# EAGLE design singleBandRepeater (EAGLE 9.6.1)

## Sheet 1 of 6: MCU
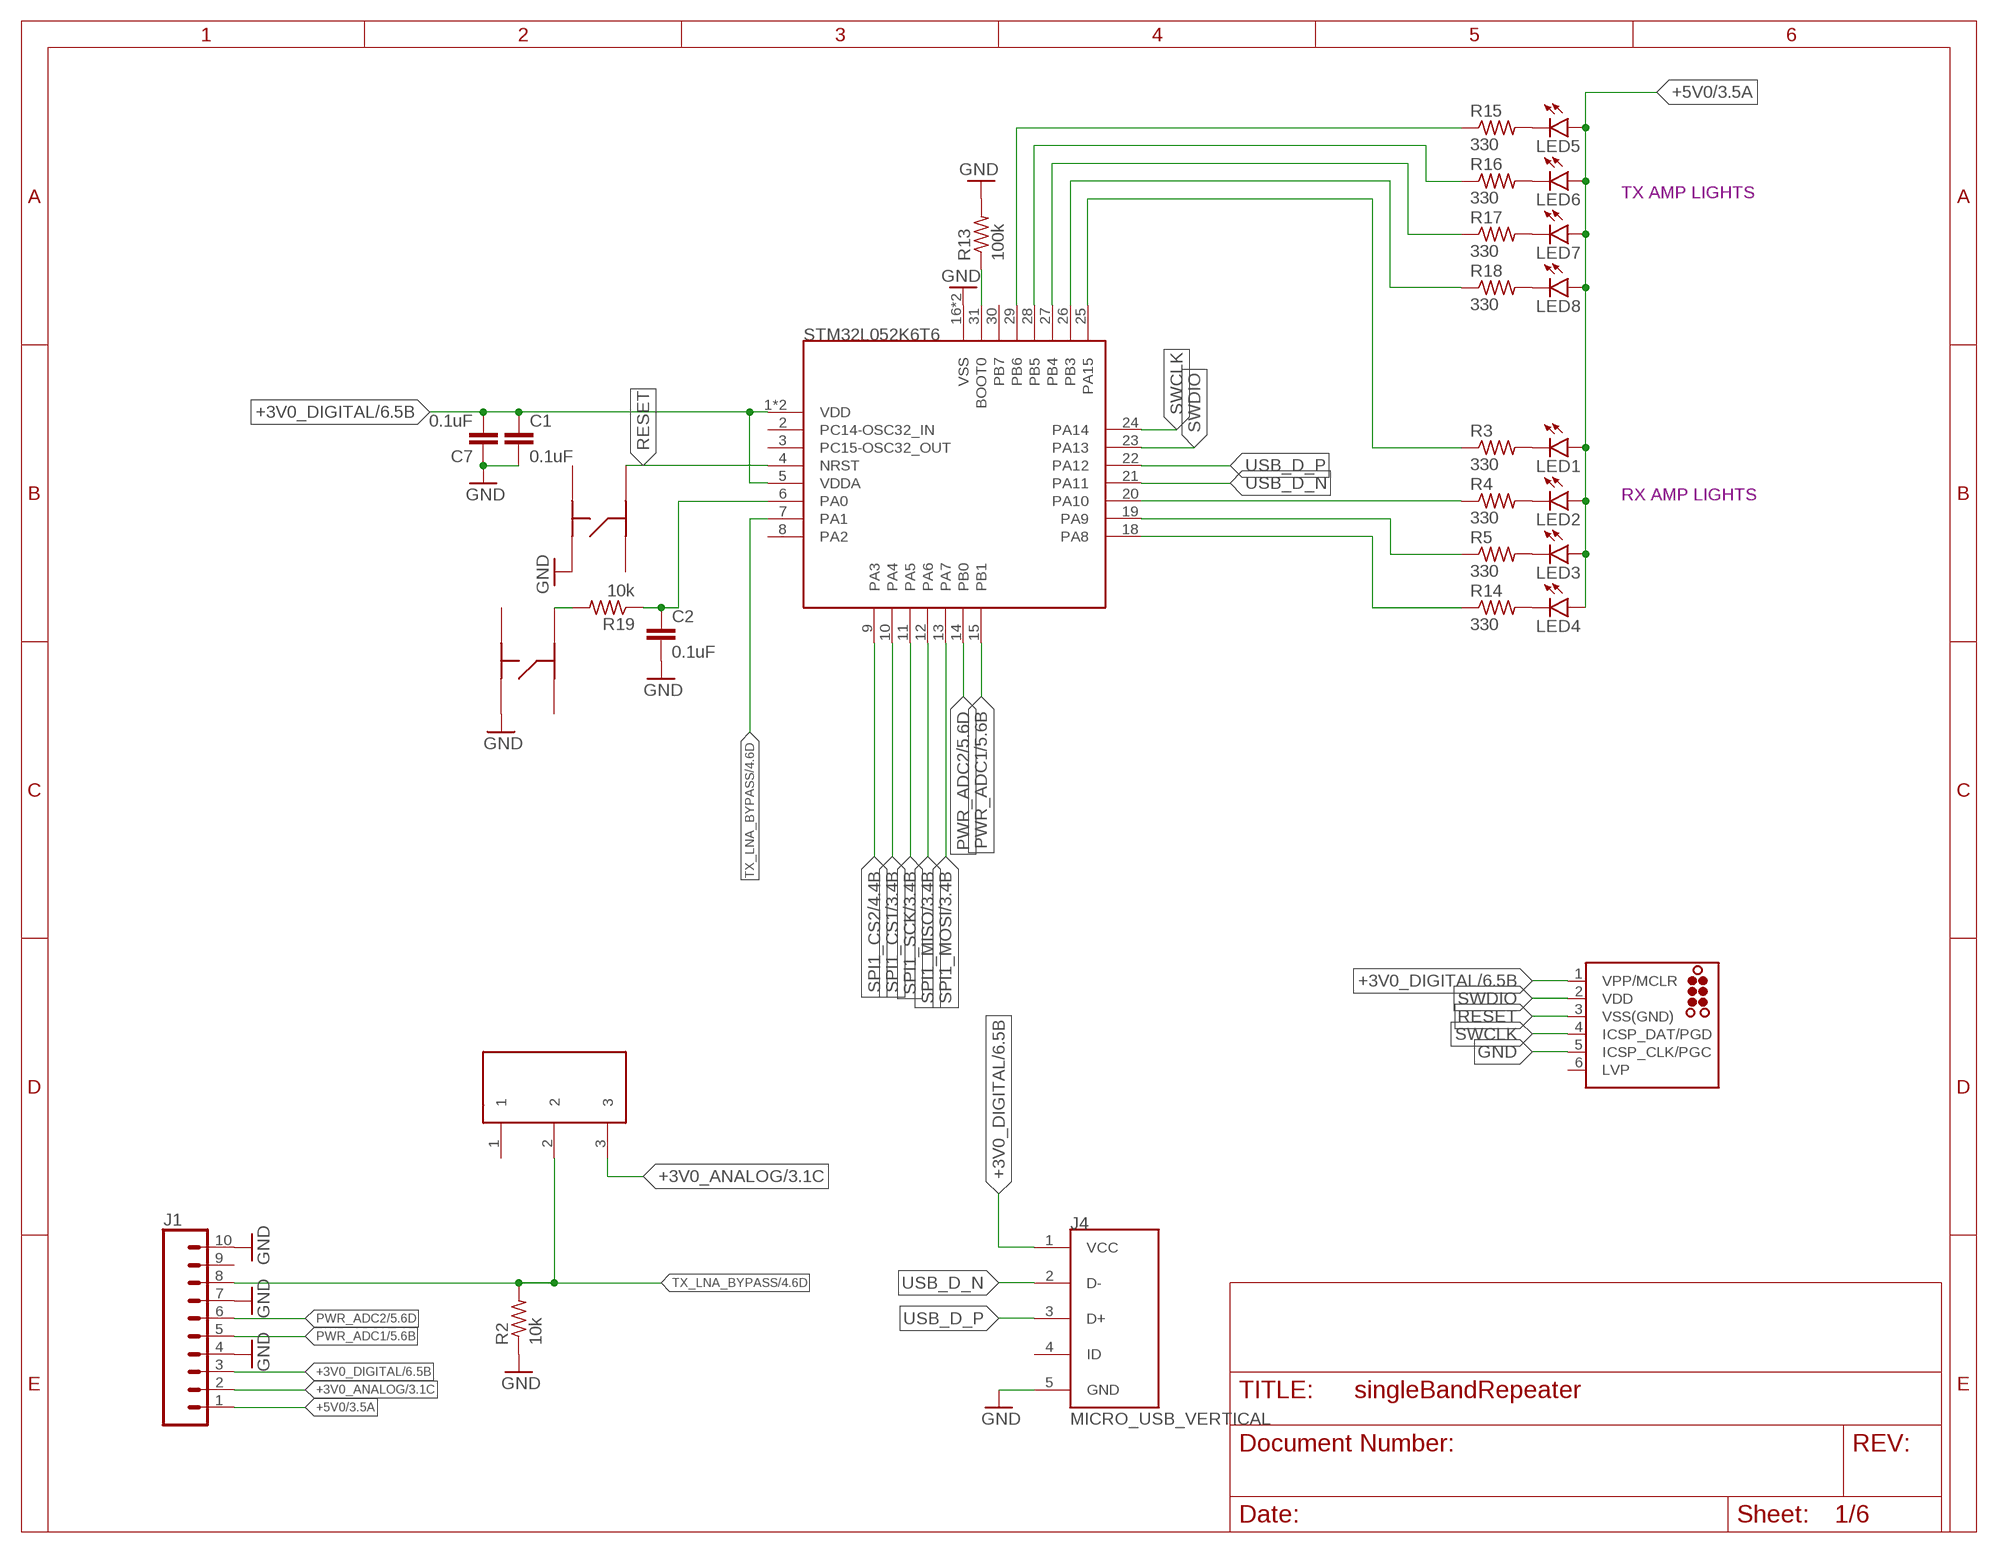
[diagram p0: schematic, sheet 1]

### Parts
C1  0.1uF  C-EUC0402  [C0402]
C2  0.1uF  C-EUC0402  [C0402]
C7  0.1uF  C-EUC0402  [C0402]
J1  CONN_10"  [1X10]
J2  TC2030-MCP  [TC2030-MCP]
J4  MICRO_USB_VERTICAL  [MICRO_USB_VERTICAL]
LED1  LEDCHIPLED_0603  [CHIPLED_0603]
LED2  LEDCHIPLED_0603  [CHIPLED_0603]
LED3  LEDCHIPLED_0603  [CHIPLED_0603]
LED4  LEDCHIPLED_0603  [CHIPLED_0603]
LED5  LEDCHIPLED_0603  [CHIPLED_0603]
LED6  LEDCHIPLED_0603  [CHIPLED_0603]
LED7  LEDCHIPLED_0603  [CHIPLED_0603]
LED8  LEDCHIPLED_0603  [CHIPLED_0603]
R2  10k  R-US_R0402  [R0402]
R3  330  R-US_R0402  [R0402]
R4  330  R-US_R0402  [R0402]
R5  330  R-US_R0402  [R0402]
R13  100k  R-US_R0402  [R0402]
R14  330  R-US_R0402  [R0402]
R15  330  R-US_R0402  [R0402]
R16  330  R-US_R0402  [R0402]
R17  330  R-US_R0402  [R0402]
R18  330  R-US_R0402  [R0402]
R19  10k  R-US_R0402  [R0402]
S1  KMR731NG  [KMR731NG]
S3  SPDT_THRU  [SPDT_THRU]
S5  KMR731NG  [KMR731NG]
U2  STM32L052K6T6LQFP32-7X7  [QFP80P900X900X160-32]

### Nets
+3V0_ANALOG: J1.2 S3.3 ; also sheet 3,4,5,6
+3V0_DIGITAL: C1.1 C7.2 J1.3 J2.1(VPP/MCLR) J4.1(VCC) U2.1(VDD) U2.5(VDDA) U2.17(VDD) ; also sheet 6
+5V0: J1.1 LED1.A LED2.A LED3.A LED4.A LED5.A LED6.A LED7.A LED8.A ; also sheet 3,4,6
GND: C1.2 C2.2 C7.1 J1.4 J1.7 J1.10 J2.5(ICSP_CLK/PGC) J4.5(GND) R2.1 R13.2 S1.P$3 S5.P$3 U2.16(VSS) U2.32(VSS) ; also sheet 2,3,4,5,6
N$4: R13.1 U2.31(BOOT0)
N$5: LED1.C R3.2
N$6: LED2.C R4.2
N$7: LED3.C R5.2
N$12: LED4.C R14.2
N$16: LED5.C R15.2
N$19: LED6.C R16.2
N$21: LED7.C R17.2
N$22: LED8.C R18.2
N$24: R18.1 U2.26(PB3)
N$25: R17.1 U2.27(PB4)
N$26: R16.1 U2.28(PB5)
N$29: R15.1 U2.29(PB6)
N$32: R3.1 U2.25(PA15)
N$35: R4.1 U2.20(PA10)
N$41: R5.1 U2.19(PA9)
N$42: R14.1 U2.18(PA8)
N$52: R19.2 S5.P$1
N$54: C2.1 R19.1 U2.6(PA0)
PWR_ADC1: J1.5 U2.15(PB1) ; also sheet 5
PWR_ADC2: J1.6 U2.14(PB0) ; also sheet 5
RESET: J2.3(VSS(GND)) S1.P$1 U2.4(NRST)
SPI1_CS1: U2.10(PA4) ; also sheet 3
SPI1_CS2: U2.9(PA3) ; also sheet 4
SPI1_MISO: U2.12(PA6) ; also sheet 3,4
SPI1_MOSI: U2.13(PA7) ; also sheet 3,4
SPI1_SCK: U2.11(PA5) ; also sheet 3,4
SWCLK: J2.4(ICSP_DAT/PGD) U2.24(PA14)
SWDIO: J2.2(VDD) U2.23(PA13)
TX_LNA_BYPASS: J1.8 R2.2 S3.2 U2.7(PA1) ; also sheet 4
USB_D_N [DIFF]: J4.2(D-) U2.21(PA11)
USB_D_P [DIFF]: J4.3(D+) U2.22(PA12)
Unconnected: J1.9 J2.6(LVP) J4.4(ID) S1.P$2 S1.P$4 S3.1 S5.P$2 S5.P$4 U2.2(PC14-OSC32_IN) U2.3(PC15-OSC32_OUT) U2.8(PA2) U2.30(PB7)

### Notes on the sheet
- TX AMP LIGHTS
- RX AMP LIGHTS

## Sheet 2 of 6: Antenna & Duplexer
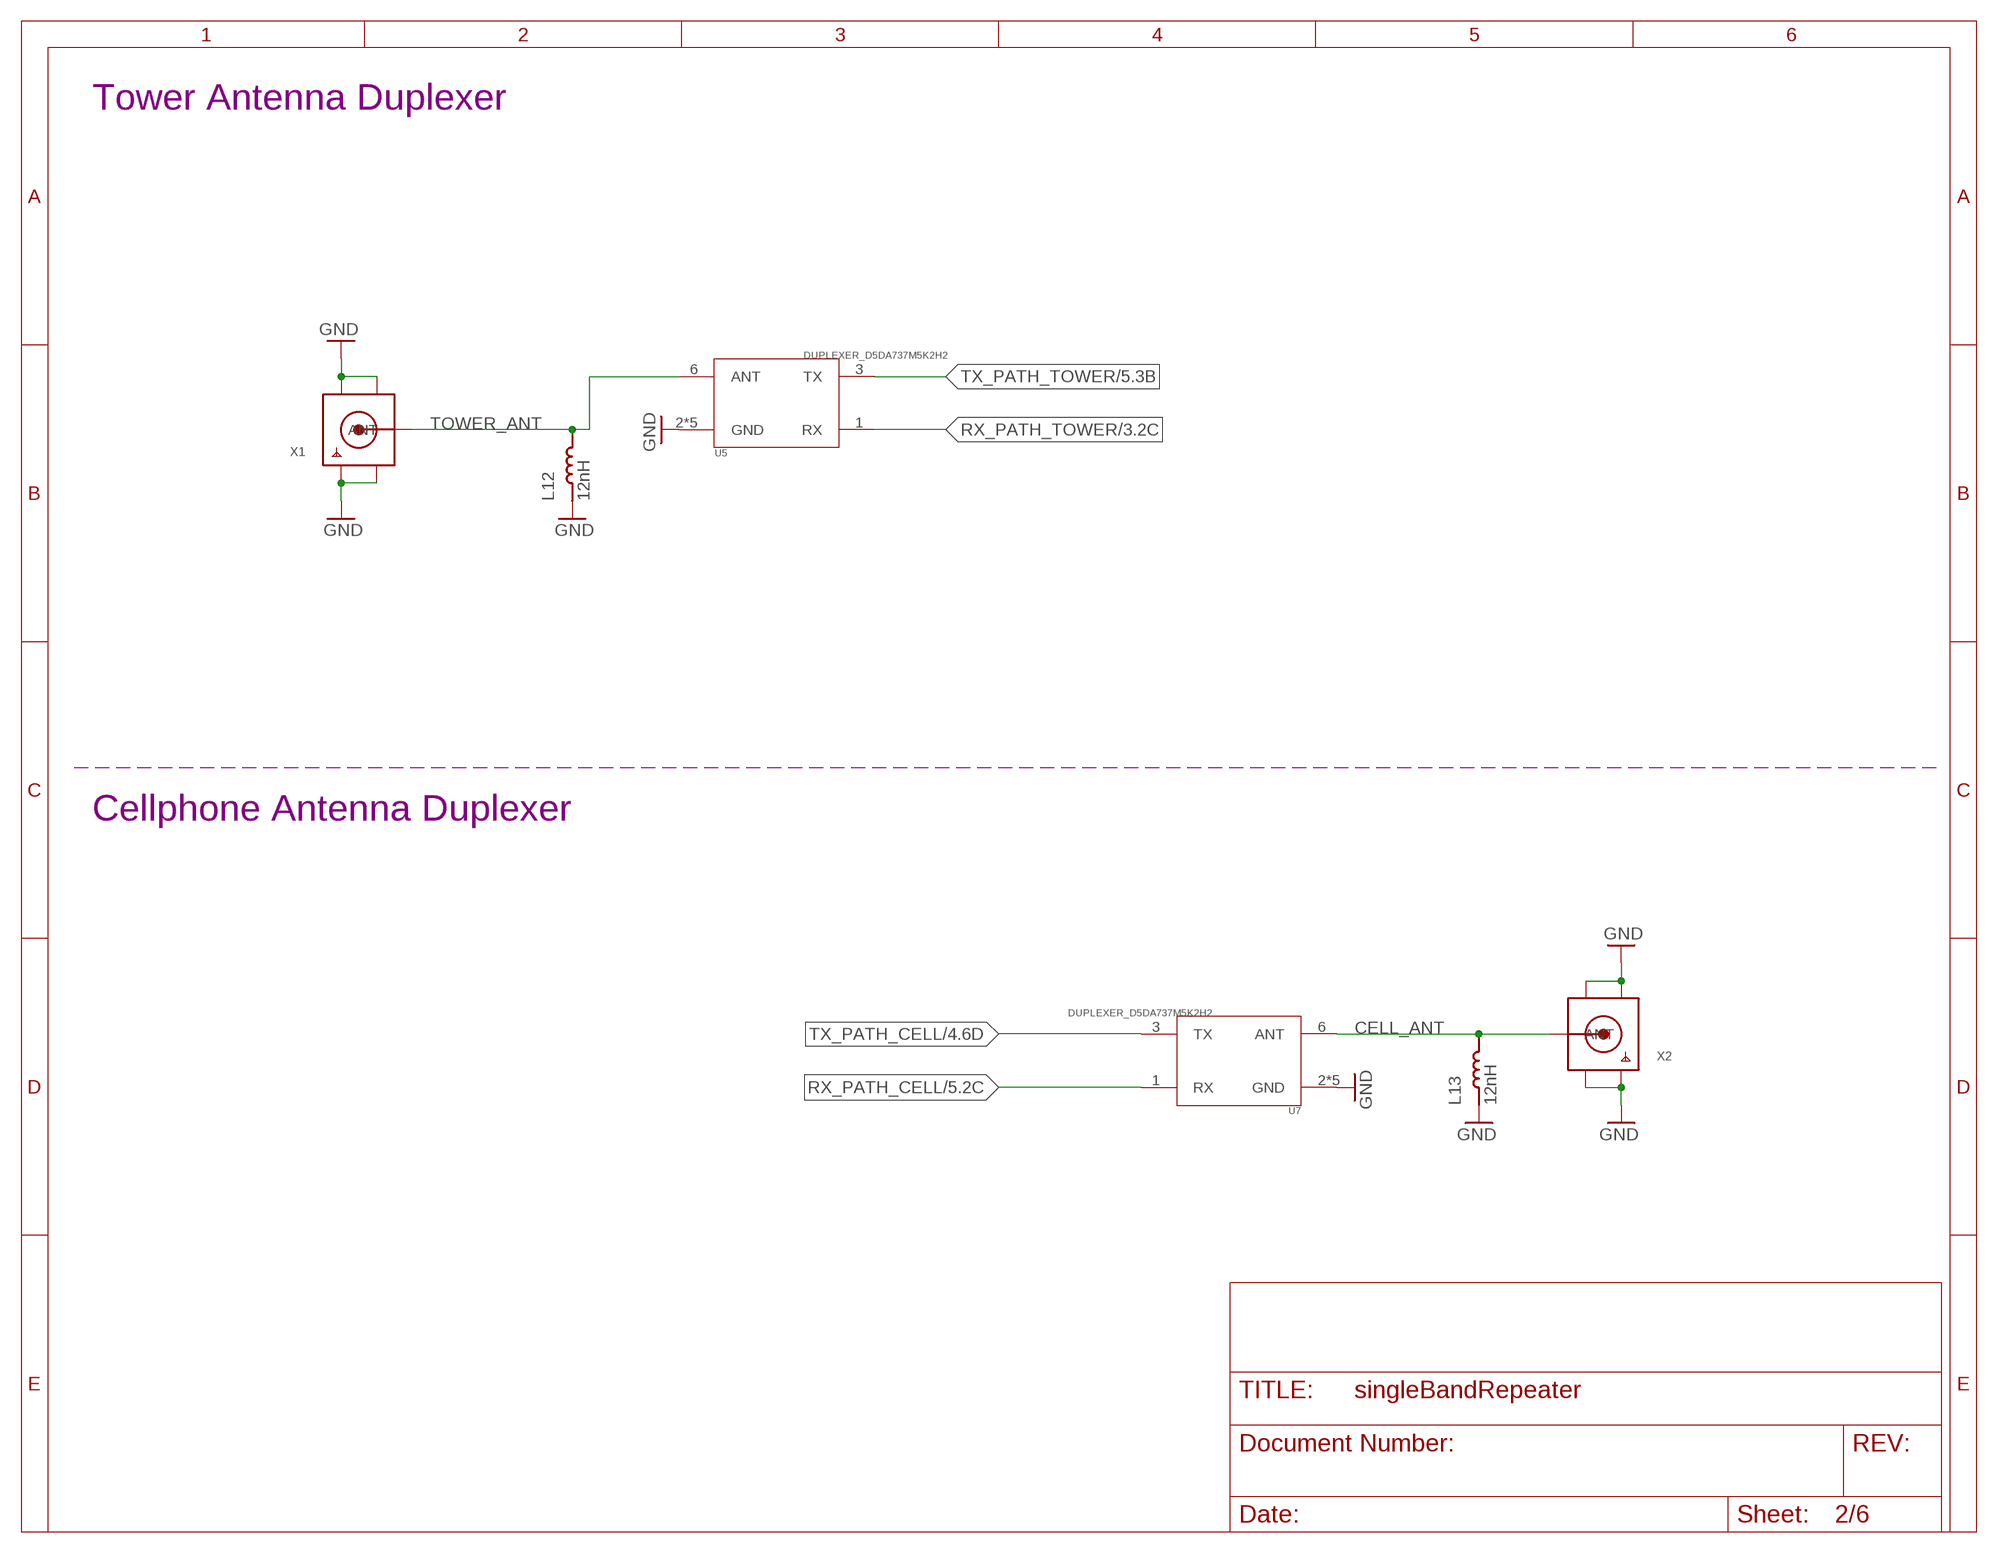
[diagram p1: schematic, sheet 2]

### Parts
L12  12nH  INDUCTOR0402  [0402]
L13  12nH  INDUCTOR0402  [0402]
U5  DUPLEXER_D5DA737M5K2H2  [TAIYO_YUDEN_DUPLEX_1.8X1.4]
U7  DUPLEXER_D5DA737M5K2H2  [TAIYO_YUDEN_DUPLEX_1.8X1.4]
X1  SMACONNECTORSMA_DIP  [SMA_DIP]
X2  SMACONNECTORSMA_DIP  [SMA_DIP]

### Nets
CELL_ANT: L13.2 U7.6(ANT) X2.ANTENNA(ANT)
GND: L12.1 L13.1 U5.2(GND) U5.4(GND) U5.5(GND) U5.7(GND) U5.8(GND) U7.2(GND) U7.4(GND) U7.5(GND) U7.7(GND) U7.8(GND) X1.GND1 X1.GND2 X1.GND3 X1.GND4 X2.GND1 X2.GND2 X2.GND3 X2.GND4 ; also sheet 1,3,4,5,6
RX_PATH_CELL: U7.1(RX) ; also sheet 5
RX_PATH_TOWER: U5.1(RX) ; also sheet 3
TOWER_ANT: L12.2 U5.6(ANT) X1.ANTENNA(ANT)
TX_PATH_CELL: U7.3(TX) ; also sheet 4
TX_PATH_TOWER: U5.3(TX) ; also sheet 5

### Notes on the sheet
- Tower Antenna Duplexer
- Cellphone Antenna Duplexer

## Sheet 3 of 6: RX RF Chain
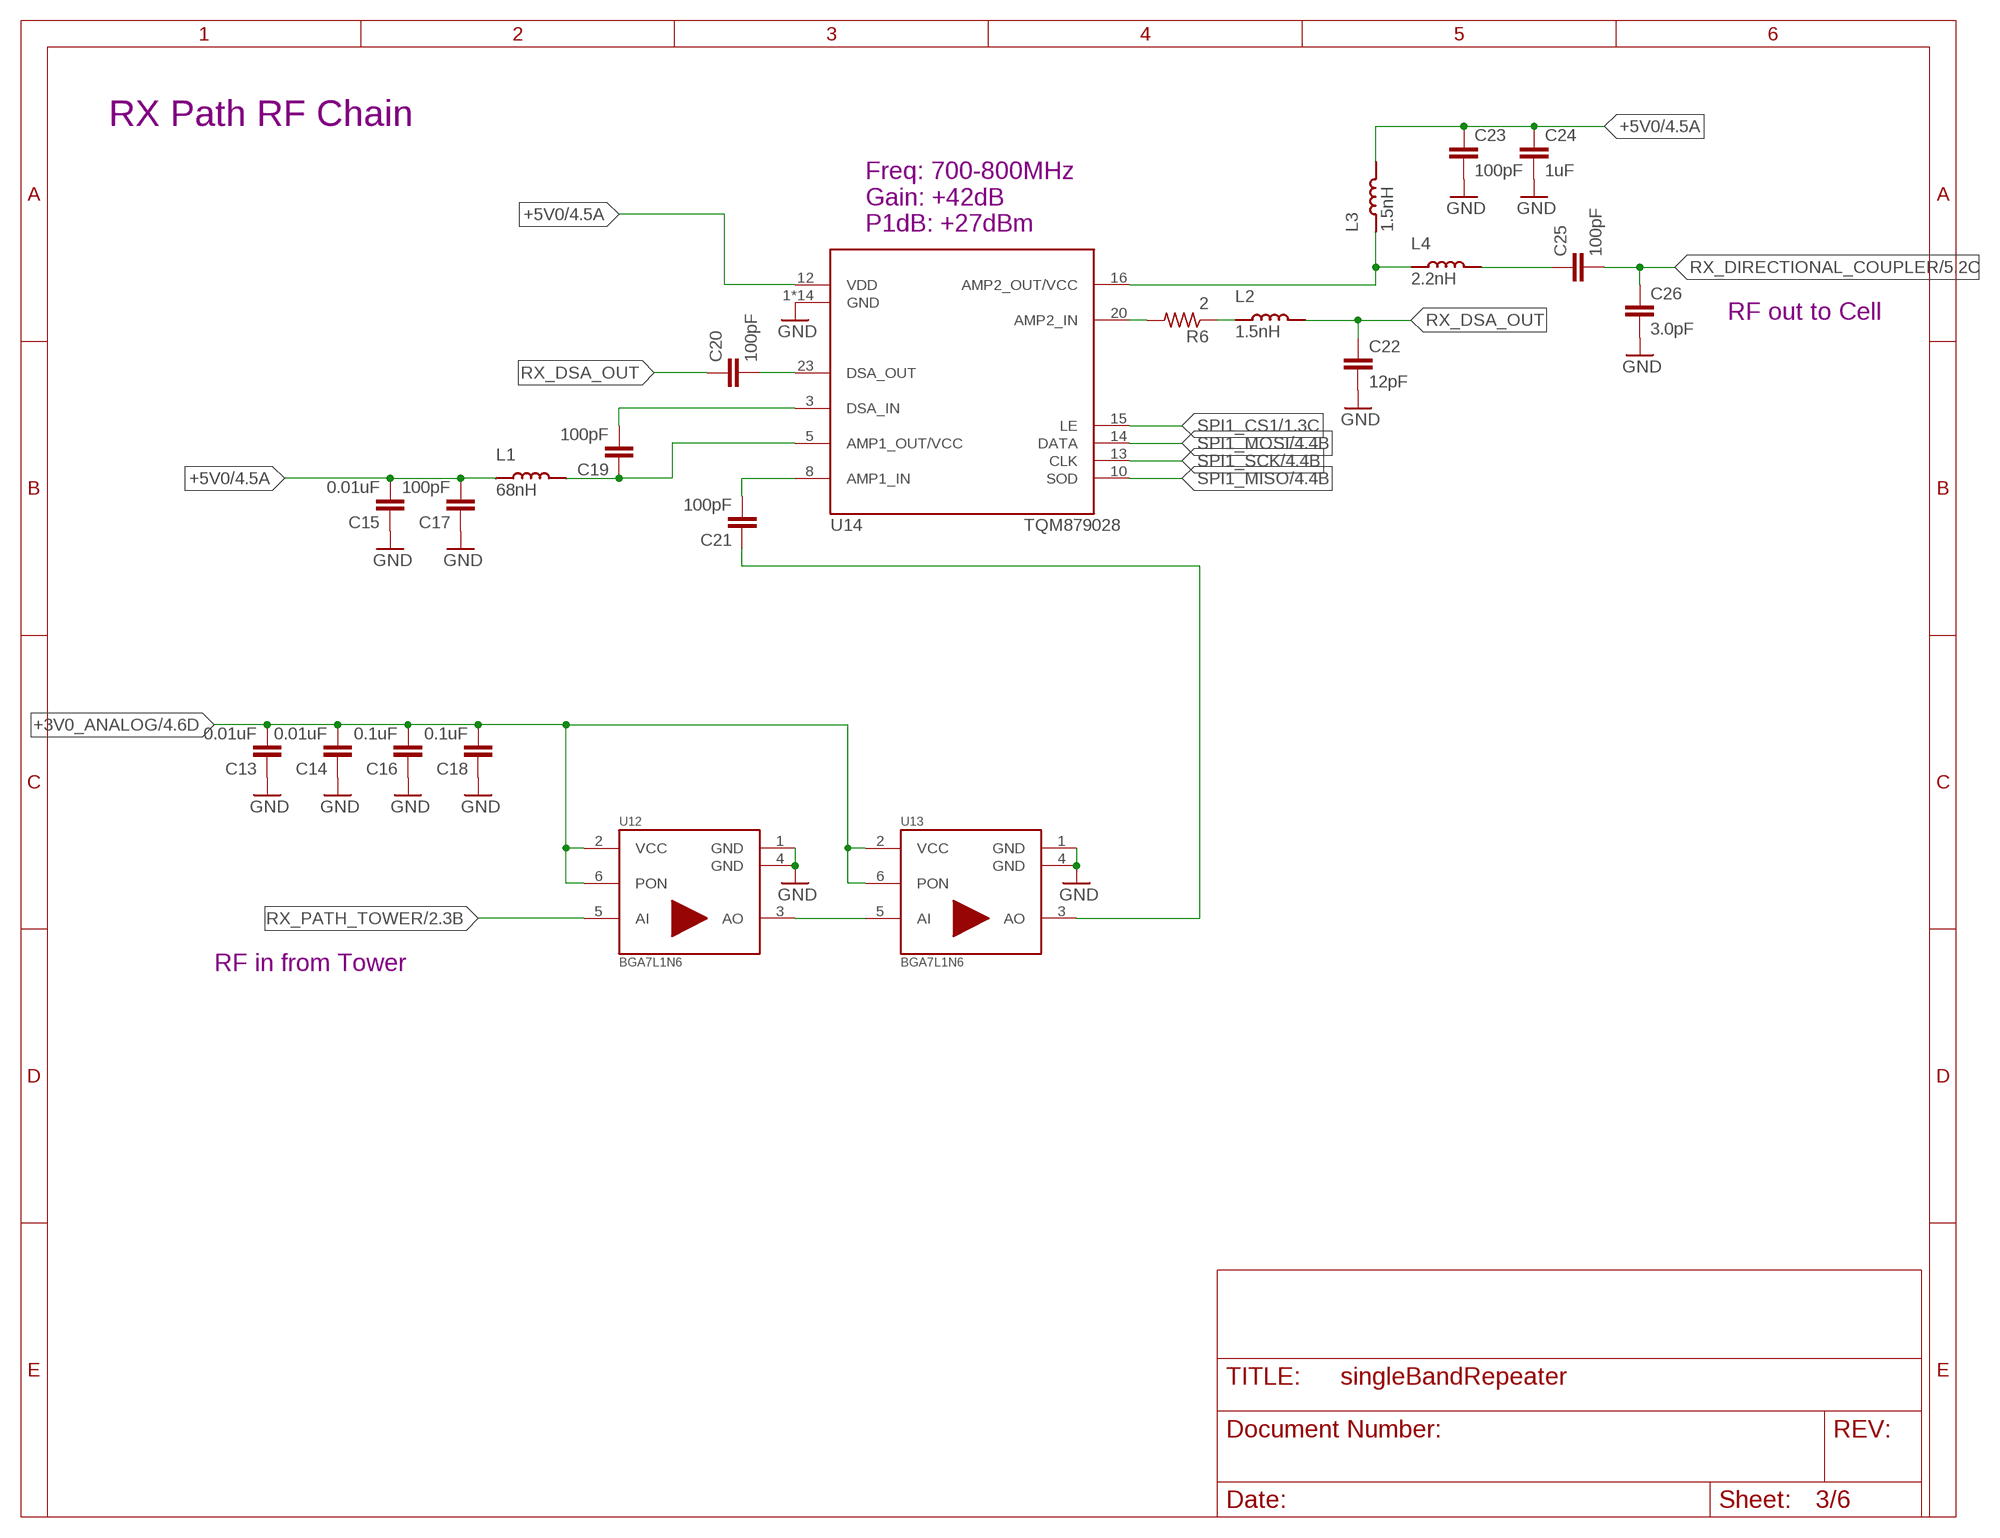
[diagram p2: schematic, sheet 3]

### Parts
C13  0.01uF  C-EUC0402  [C0402]
C14  0.01uF  C-EUC0402  [C0402]
C15  0.01uF  C-EUC0402  [C0402]
C16  0.1uF  C-EUC0402  [C0402]
C17  100pF  C-EUC0402  [C0402]
C18  0.1uF  C-EUC0402  [C0402]
C19  100pF  C-EUC0402  [C0402]
C20  100pF  C-EUC0402  [C0402]
C21  100pF  C-EUC0402  [C0402]
C22  12pF  C-EUC0402  [C0402]
C23  100pF  C-EUC0402  [C0402]
C24  1uF  C-EUC0402  [C0402]
C25  100pF  C-EUC0402  [C0402]
C26  3.0pF  C-EUC0402  [C0402]
L1  68nH  INDUCTOR0402  [0402]
L2  1.5nH  INDUCTOR0402  [0402]
L3  1.5nH  INDUCTOR0402  [0402]
L4  2.2nH  INDUCTOR0402  [0402]
R6  2  R-US_R0402  [R0402]
U12  BGA7L1N6  [INF-PG-TSNP-6-2]
U13  BGA7L1N6  [INF-PG-TSNP-6-2]
U14  TQM879028  [QFN50P400X400X100-25T270N]

### Nets
+3V0_ANALOG: C13.2 C14.2 C16.2 C18.2 U12.2(VCC) U12.6(PON) U13.2(VCC) U13.6(PON) ; also sheet 1,4,5,6
+5V0: C15.2 C17.2 C23.1 C24.1 L1.1 L3.2 U14.12(VDD) ; also sheet 1,4,6
GND: C13.1 C14.1 C15.1 C16.1 C17.1 C18.1 C22.2 C23.2 C24.2 C26.2 U12.1(GND) U12.4(GND) U13.1(GND) U13.4(GND) U14.1(GND) U14.2(GND) U14.4(GND) U14.6(GND) U14.7(GND) U14.9(GND) U14.11(GND) U14.17(GND) U14.18(GND) U14.19(GND) U14.21(GND) U14.22(GND) U14.24(GND) U14.25(GND) ; also sheet 1,2,4,5,6
N$8: U12.3(AO) U13.5(AI)
N$9: C21.1 U13.3(AO)
N$10: C21.2 U14.8(AMP1_IN)
N$11: C19.1 L1.2 U14.5(AMP1_OUT/VCC)
N$13: C20.2 U14.23(DSA_OUT)
N$14: C19.2 U14.3(DSA_IN)
N$15: L3.1 L4.1 U14.16(AMP2_OUT/VCC)
N$17: L2.1 R6.1
N$18: R6.2 U14.20(AMP2_IN)
N$20: C25.1 L4.2
RX_DIRECTIONAL_COUPLER: C25.2 C26.1 ; also sheet 5
RX_DSA_OUT: C20.1 C22.1 L2.2
RX_PATH_TOWER: U12.5(AI) ; also sheet 2
SPI1_CS1: U14.15(LE) ; also sheet 1
SPI1_MISO: U14.10(SOD) ; also sheet 1,4
SPI1_MOSI: U14.14(DATA) ; also sheet 1,4
SPI1_SCK: U14.13(CLK) ; also sheet 1,4

### Notes on the sheet
- RX Path RF Chain
- Freq: 700-800MHz
  Gain: +42dB
  P1dB: +27dBm
- RF out to Cell
- RF in from Tower

## Sheet 4 of 6: TX RF Chain
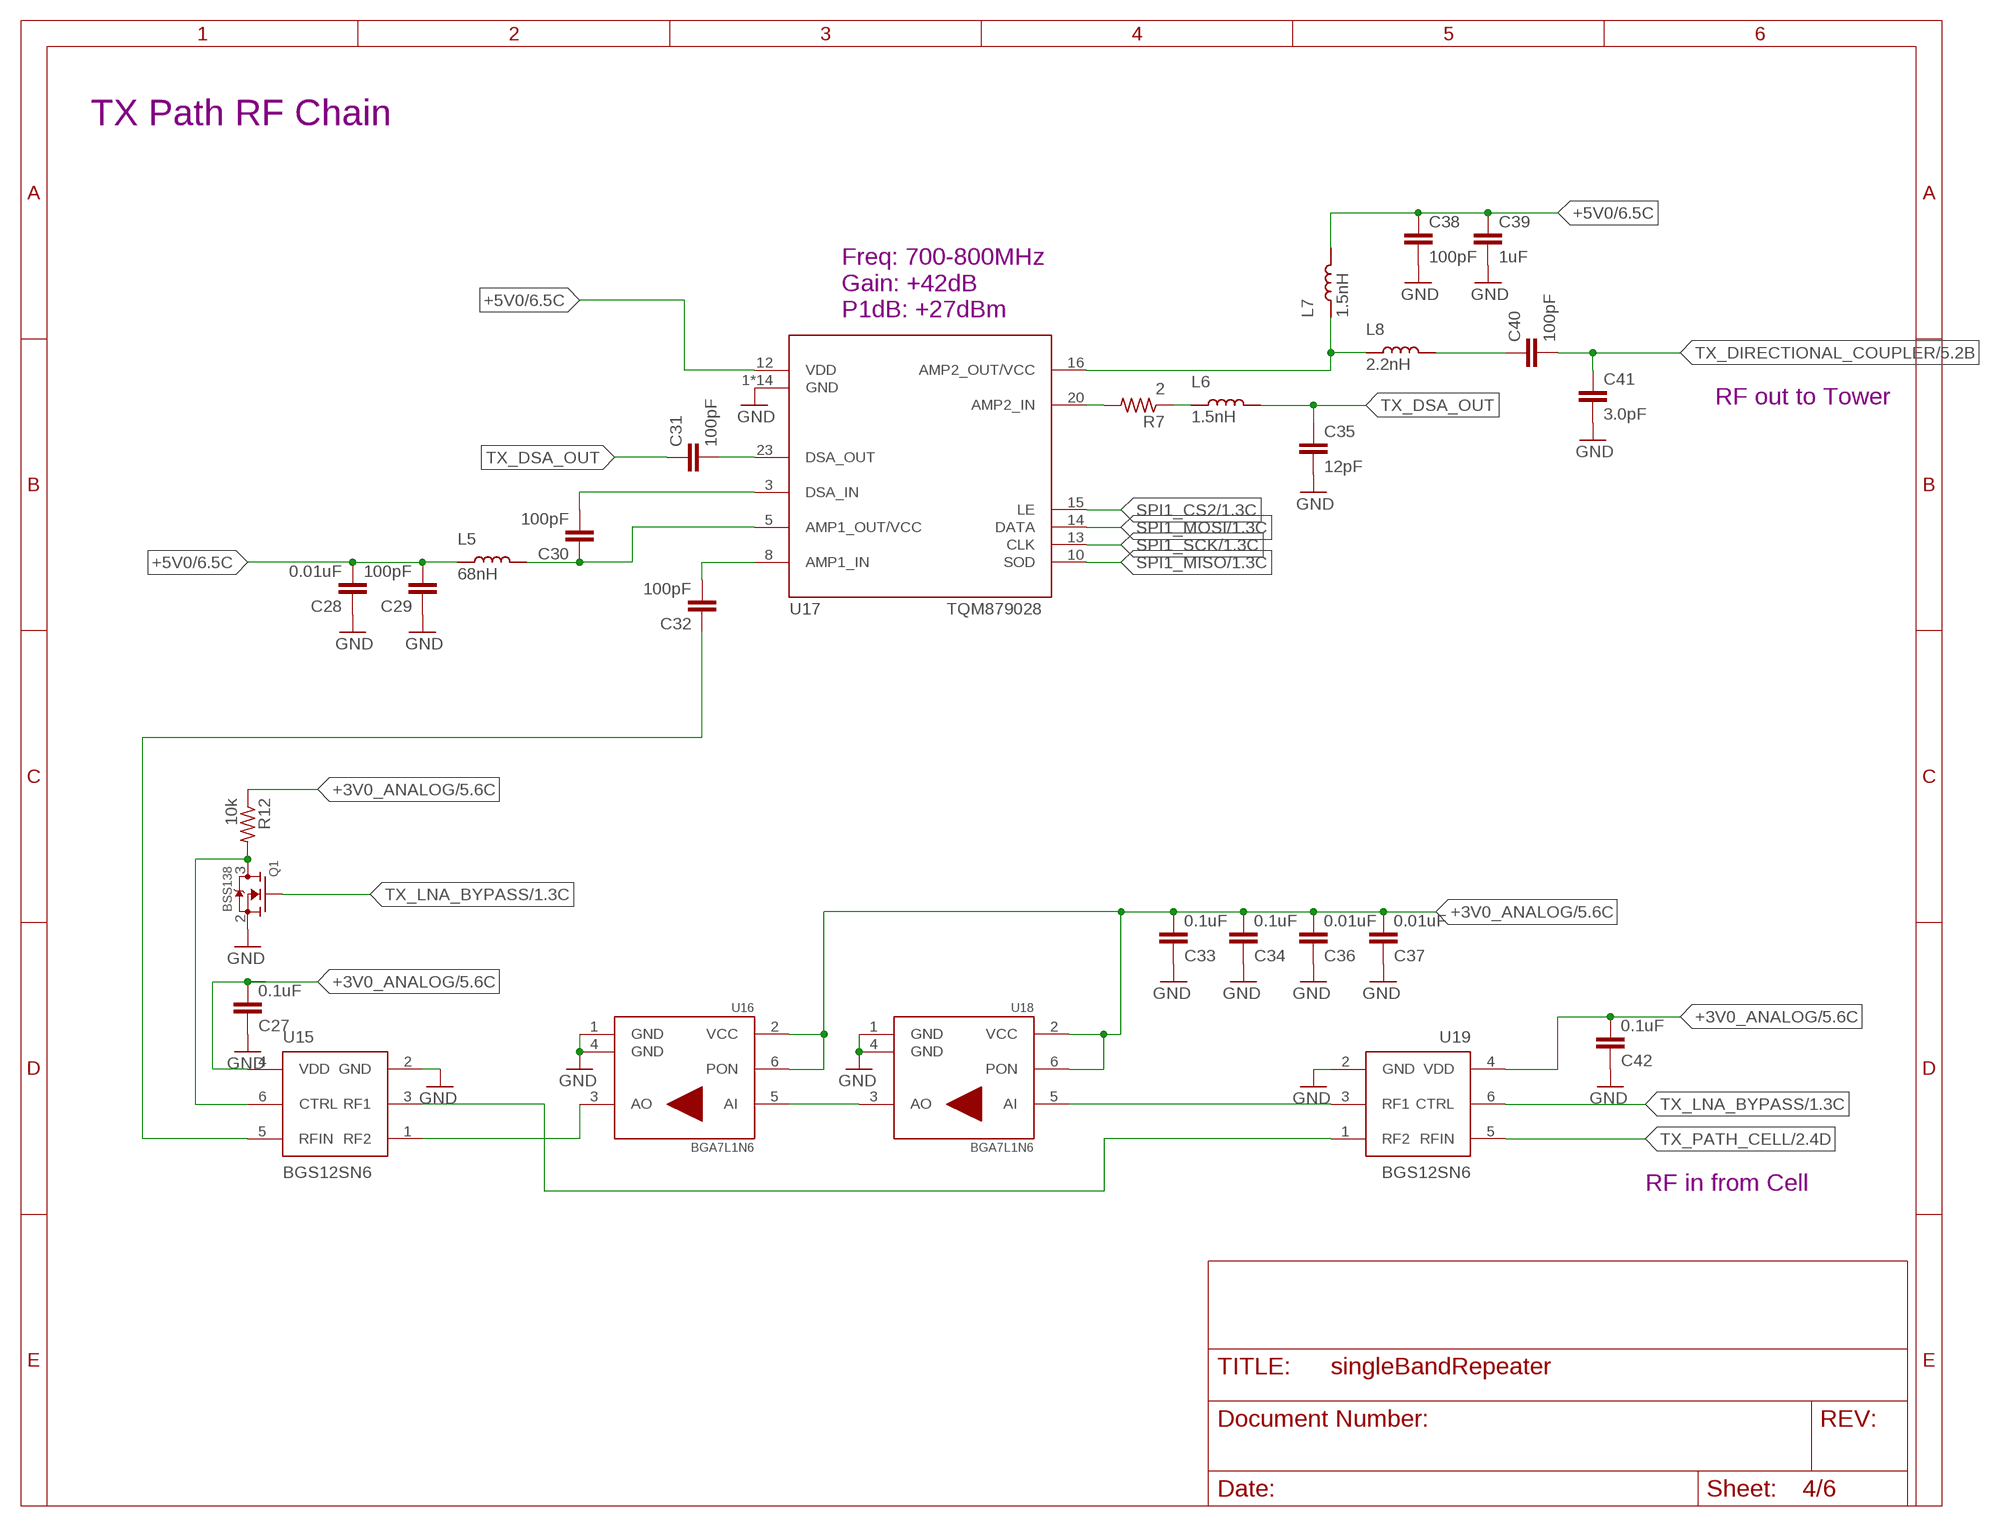
[diagram p3: schematic, sheet 4]

### Parts
C27  0.1uF  C-EUC0402  [C0402]
C28  0.01uF  C-EUC0402  [C0402]
C29  100pF  C-EUC0402  [C0402]
C30  100pF  C-EUC0402  [C0402]
C31  100pF  C-EUC0402  [C0402]
C32  100pF  C-EUC0402  [C0402]
C33  0.1uF  C-EUC0402  [C0402]
C34  0.1uF  C-EUC0402  [C0402]
C35  12pF  C-EUC0402  [C0402]
C36  0.01uF  C-EUC0402  [C0402]
C37  0.01uF  C-EUC0402  [C0402]
C38  100pF  C-EUC0402  [C0402]
C39  1uF  C-EUC0402  [C0402]
C40  100pF  C-EUC0402  [C0402]
C41  3.0pF  C-EUC0402  [C0402]
C42  0.1uF  C-EUC0402  [C0402]
L5  68nH  INDUCTOR0402  [0402]
L6  1.5nH  INDUCTOR0402  [0402]
L7  1.5nH  INDUCTOR0402  [0402]
L8  2.2nH  INDUCTOR0402  [0402]
Q1  BSS138  [SOT23-3]
R7  2  R-US_R0402  [R0402]
R12  10k  R-US_R0402  [R0402]
U15  BGS12SN6  [INF-PG-TSNP-6-2]
U16  BGA7L1N6  [INF-PG-TSNP-6-2]
U17  TQM879028  [QFN50P400X400X100-25T270N]
U18  BGA7L1N6  [INF-PG-TSNP-6-2]
U19  BGS12SN6  [INF-PG-TSNP-6-2]

### Nets
+3V0_ANALOG: C27.2 C33.2 C34.2 C36.2 C37.2 C42.2 R12.1 U15.4(VDD) U16.2(VCC) U16.6(PON) U18.2(VCC) U18.6(PON) U19.4(VDD) ; also sheet 1,3,5,6
+5V0: C28.2 C29.2 C38.1 C39.1 L5.1 L7.2 U17.12(VDD) ; also sheet 1,3,6
GND: C27.1 C28.1 C29.1 C33.1 C34.1 C35.2 C36.1 C37.1 C38.2 C39.2 C41.2 C42.1 Q1.2(S) U15.2(GND) U16.1(GND) U16.4(GND) U17.1(GND) U17.2(GND) U17.4(GND) U17.6(GND) U17.7(GND) U17.9(GND) U17.11(GND) U17.17(GND) U17.18(GND) U17.19(GND) U17.21(GND) U17.22(GND) U17.24(GND) U17.25(GND) U18.1(GND) U18.4(GND) U19.2(GND) ; also sheet 1,2,3,5,6
N$1: U15.1(RF2) U16.3(AO)
N$27: U16.5(AI) U18.3(AO)
N$30: C32.2 U17.8(AMP1_IN)
N$33: C30.1 L5.2 U17.5(AMP1_OUT/VCC)
N$34: C30.2 U17.3(DSA_IN)
N$36: C31.2 U17.23(DSA_OUT)
N$37: L6.1 R7.1
N$38: R7.2 U17.20(AMP2_IN)
N$39: L7.1 L8.1 U17.16(AMP2_OUT/VCC)
N$40: C40.1 L8.2
N$43: U18.5(AI) U19.3(RF1)
N$44: U15.3(RF1) U19.1(RF2)
N$45: C32.1 U15.5(RFIN)
N$60: Q1.3(D) R12.2 U15.6(CTRL)
SPI1_CS2: U17.15(LE) ; also sheet 1
SPI1_MISO: U17.10(SOD) ; also sheet 1,3
SPI1_MOSI: U17.14(DATA) ; also sheet 1,3
SPI1_SCK: U17.13(CLK) ; also sheet 1,3
TX_DIRECTIONAL_COUPLER: C40.2 C41.1 ; also sheet 5
TX_DSA_OUT: C31.1 C35.1 L6.2
TX_LNA_BYPASS: Q1.1(G) U19.6(CTRL) ; also sheet 1
TX_PATH_CELL: U19.5(RFIN) ; also sheet 2

### Notes on the sheet
- TX Path RF Chain
- Freq: 700-800MHz
  Gain: +42dB
  P1dB: +27dBm
- RF out to Tower
- RF in from Cell

## Sheet 5 of 6: RF Power Meter
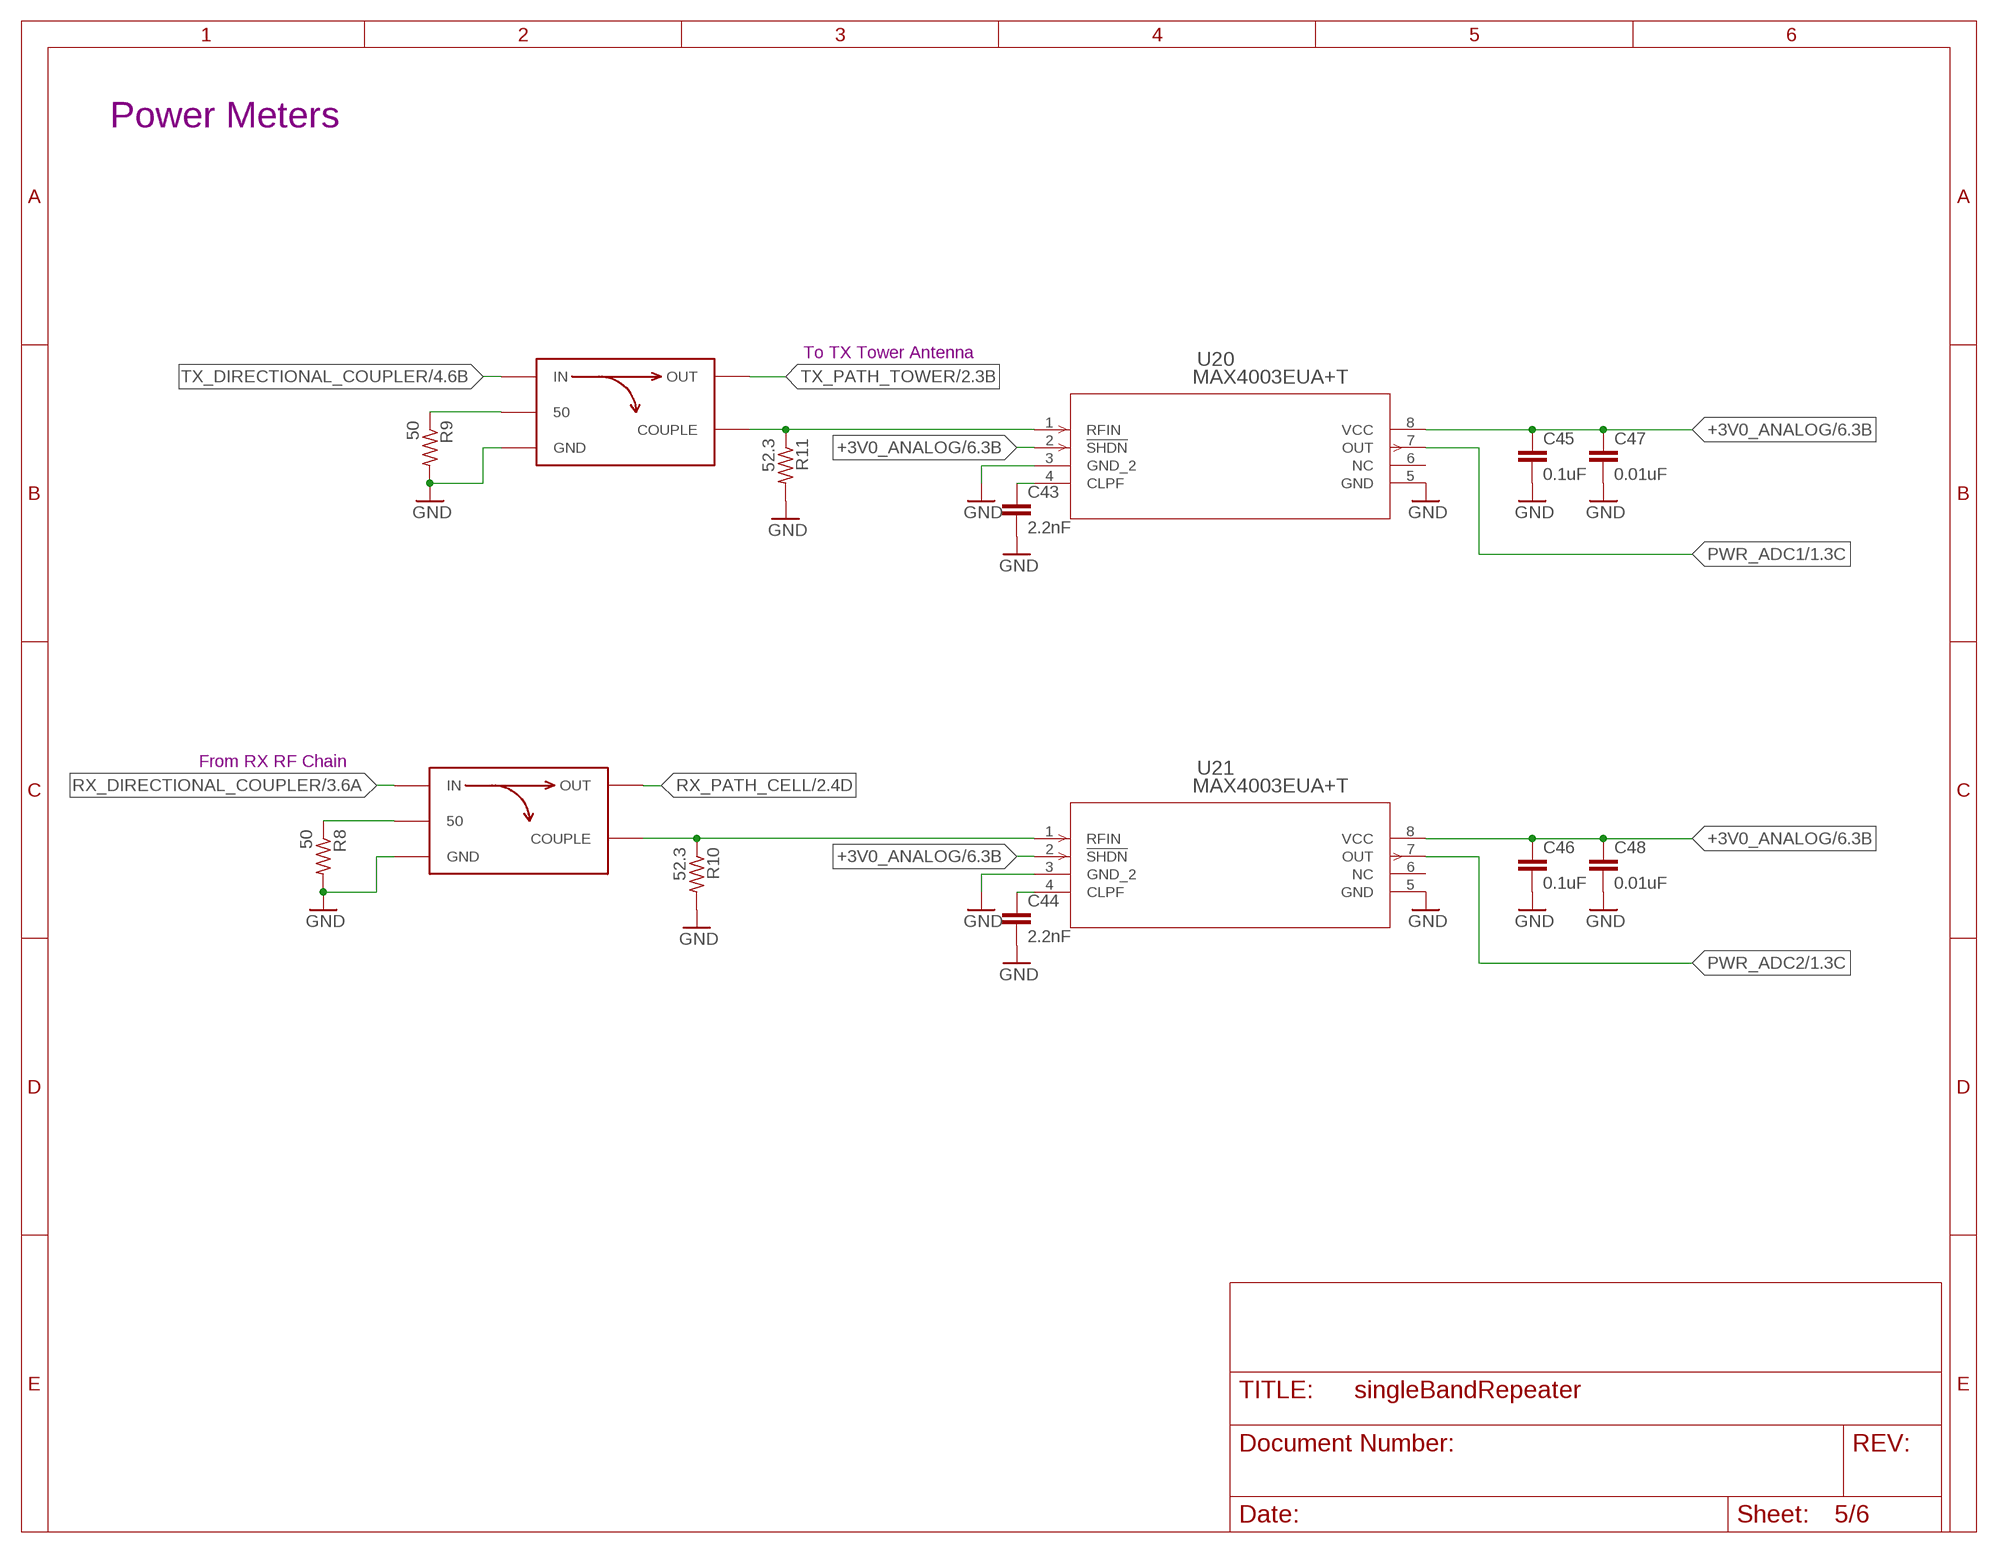
[diagram p4: schematic, sheet 5]

### Parts
C43  2.2nF  C-EUC0402  [C0402]
C44  2.2nF  C-EUC0402  [C0402]
C45  0.1uF  C-EUC0402  [C0402]
C46  0.1uF  C-EUC0402  [C0402]
C47  0.01uF  C-EUC0402  [C0402]
C48  0.01uF  C-EUC0402  [C0402]
HY1  HHM22152A2  [HHM22152A2]
HY2  HHM22152A2  [HHM22152A2]
R8  50  R-US_R0402  [R0402]
R9  50  R-US_R0402  [R0402]
R10  52.3  R-US_R0402  [R0402]
R11  52.3  R-US_R0402  [R0402]
U20  MAX4003EUA+T  [21-0036K]
U21  MAX4003EUA+T  [21-0036K]

### Nets
+3V0_ANALOG: C45.1 C46.1 C47.1 C48.1 U20.2(!SHDN) U20.8(VCC) U21.2(!SHDN) U21.8(VCC) ; also sheet 1,3,4,6
GND: C43.2 C44.2 C45.2 C46.2 C47.2 C48.2 HY1.P$2(GND) HY1.P$5(GND) HY2.P$2(GND) HY2.P$5(GND) R8.2 R9.2 R10.2 R11.2 U20.3(GND_2) U20.5(GND) U21.3(GND_2) U21.5(GND) ; also sheet 1,2,3,4,6
N$28: HY2.P$4 R9.1
N$46: C43.1 U20.4(CLPF)
N$47: HY2.P$6(COUPLE) R11.1 U20.1(RFIN)
N$48: HY1.P$4 R8.1
N$49: C44.1 U21.4(CLPF)
N$50: HY1.P$6(COUPLE) R10.1 U21.1(RFIN)
PWR_ADC1: U20.7(OUT) ; also sheet 1
PWR_ADC2: U21.7(OUT) ; also sheet 1
RX_DIRECTIONAL_COUPLER: HY1.P$1(IN) ; also sheet 3
RX_PATH_CELL: HY1.P$3(OUT) ; also sheet 2
TX_DIRECTIONAL_COUPLER: HY2.P$1(IN) ; also sheet 4
TX_PATH_TOWER: HY2.P$3(OUT) ; also sheet 2
Unconnected: U20.6(NC) U21.6(NC)

### Notes on the sheet
- Power Meters
- To TX Tower Antenna
- From RX RF Chain

## Sheet 6 of 6: Power
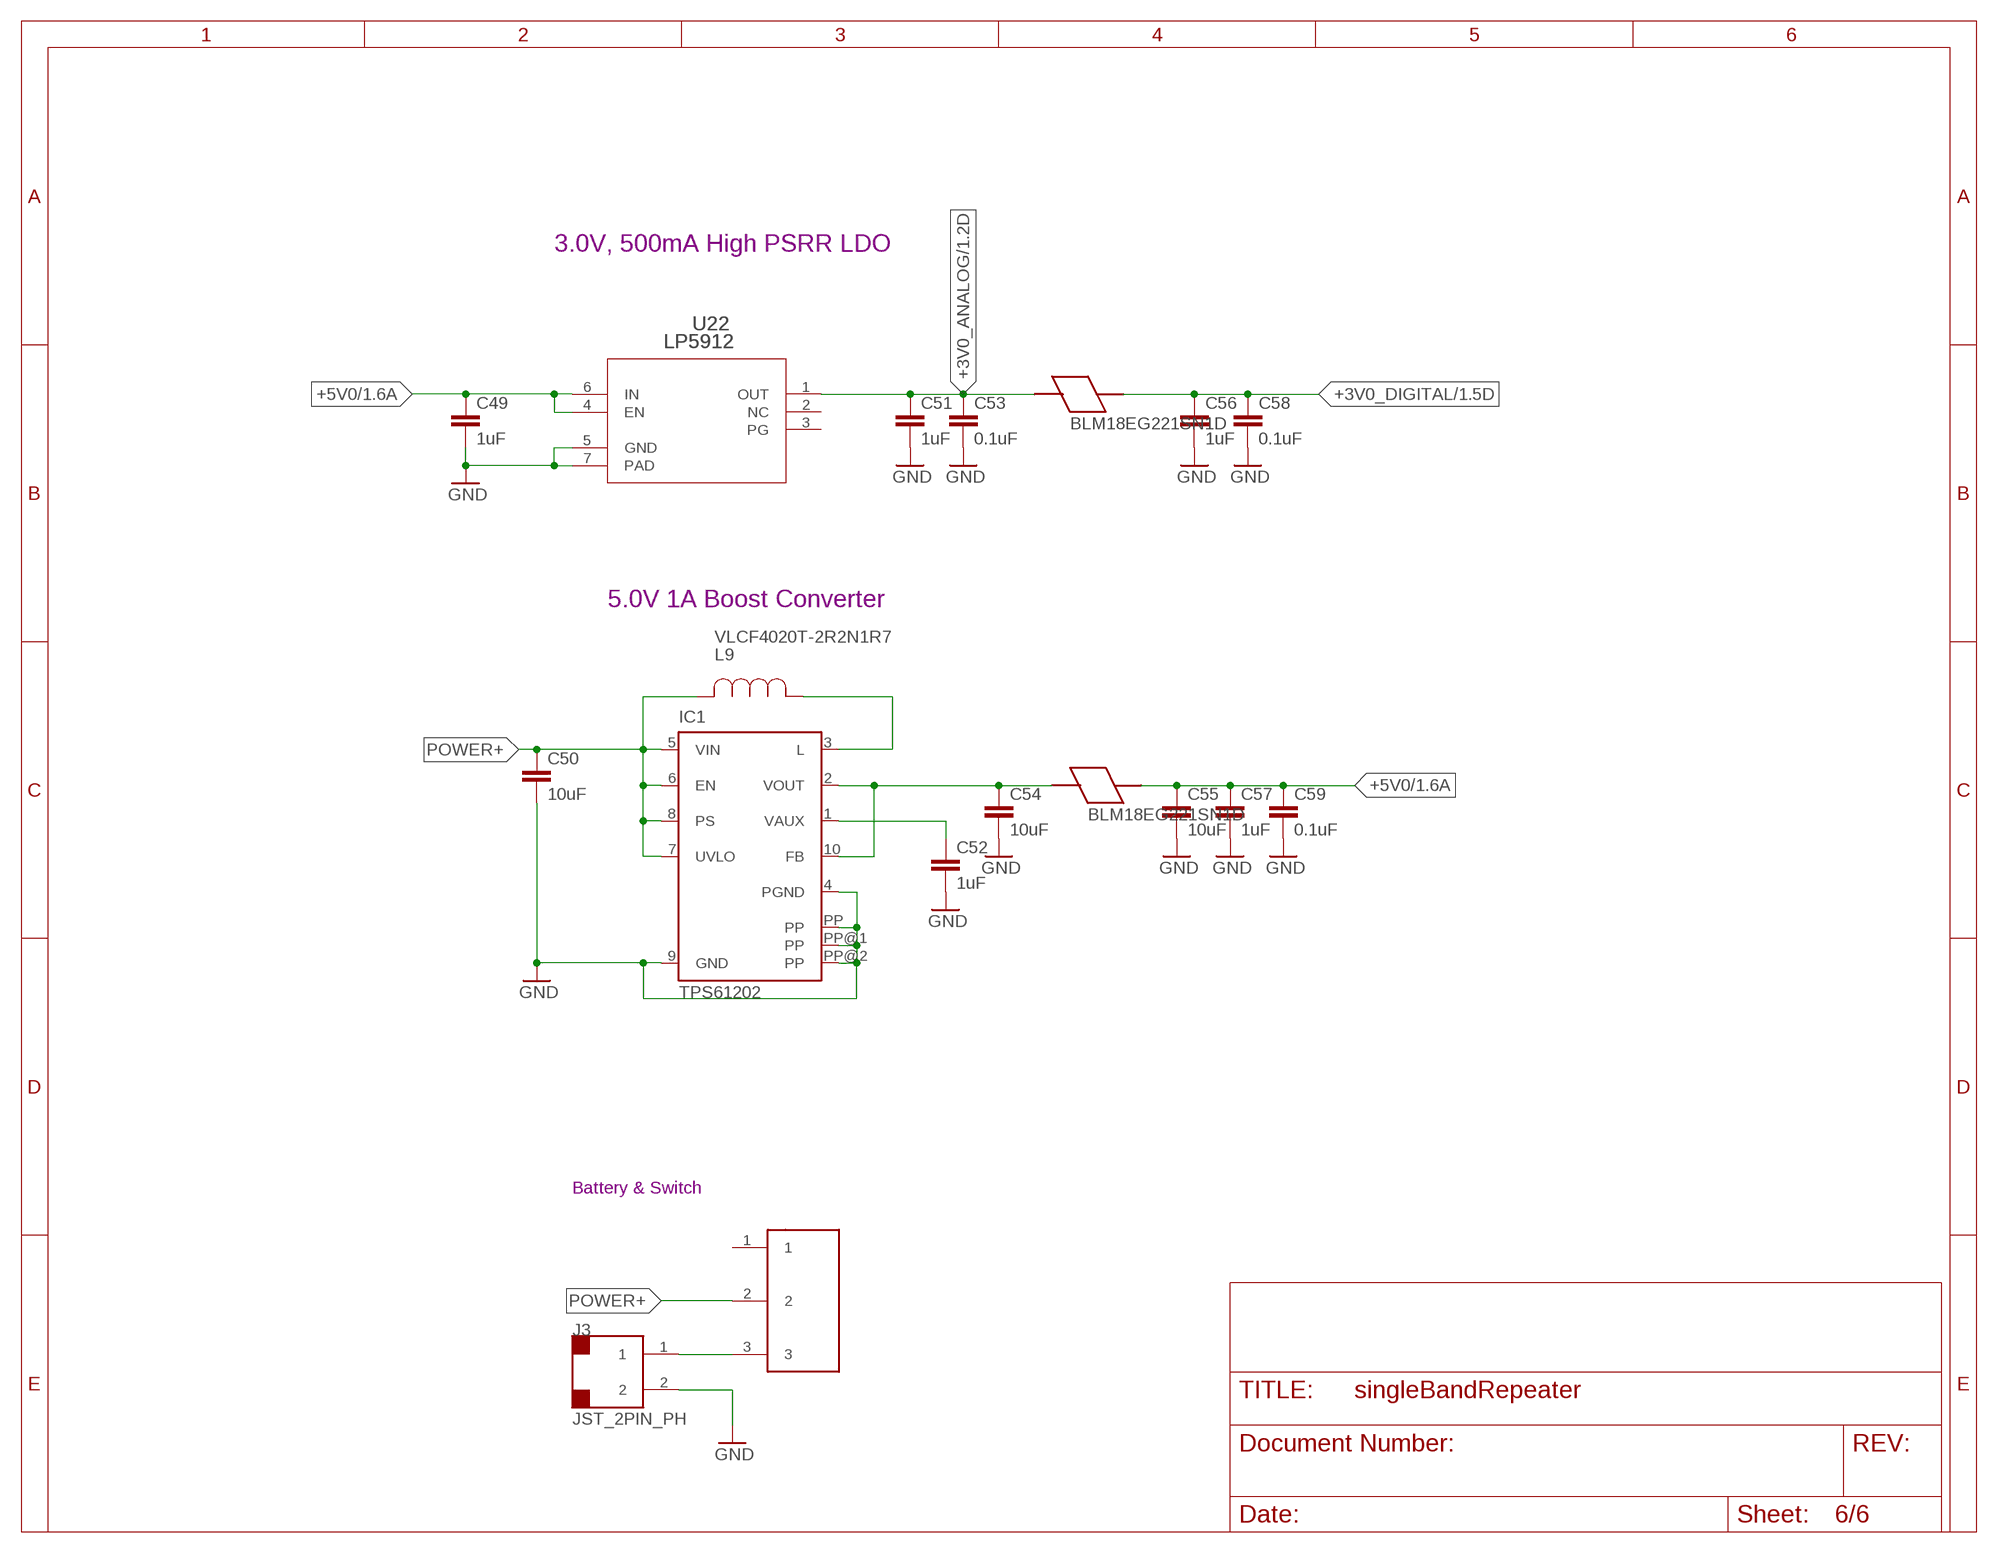
[diagram p5: schematic, sheet 6]

### Parts
C49  1uF  C-EUC0402  [C0402]
C50  10uF  C-EUC0805  [C0805]
C51  1uF  C-EUC0402  [C0402]
C52  1uF  C-EUC0402  [C0402]
C53  0.1uF  C-EUC0402  [C0402]
C54  10uF  C-EUC0805  [C0805]
C55  10uF  C-EUC0805  [C0805]
C56  1uF  C-EUC0402  [C0402]
C57  1uF  C-EUC0402  [C0402]
C58  0.1uF  C-EUC0402  [C0402]
C59  0.1uF  C-EUC0402  [C0402]
IC1  TPS61202  [S-PDSO-N10]
J3  JST_2PIN_PH  [JST_2PIN_PH]
L9  VLCF4020T-2R2N1R7  [IND_4028]
L10  BLM18EG221SN1D  [IND_BLM18_0603]
L11  BLM18EG221SN1D  [IND_BLM18_0603]
S4  SPDT_THRU  [SPDT_THRU]
U22  LP5912  [DRV0006A]

### Nets
+3V0_ANALOG: C51.1 C53.1 L10.1 U22.1(OUT) ; also sheet 1,3,4,5
+3V0_DIGITAL: C56.1 C58.1 L10.2 ; also sheet 1
+5V0: C49.1 C55.1 C57.1 C59.1 L11.2 U22.4(EN) U22.6(IN) ; also sheet 1,3,4
GND: C49.2 C50.2 C51.2 C52.2 C53.2 C54.2 C55.2 C56.2 C57.2 C58.2 C59.2 IC1.4(PGND) IC1.9(GND) IC1.PP IC1.PP@1(PP) IC1.PP@2(PP) J3.2 U22.5(GND) U22.7(PAD) ; also sheet 1,2,3,4,5
N$2: J3.1 S4.3
N$31: IC1.3(L) L9.1
N$51: C54.1 IC1.2(VOUT) IC1.10(FB) L11.1
N$53: C52.1 IC1.1(VAUX)
POWER+: C50.1 IC1.5(VIN) IC1.6(EN) IC1.7(UVLO) IC1.8(PS) L9.2 S4.2
Unconnected: S4.1 U22.2(NC) U22.3(PG)

### Notes on the sheet
- 3.0V, 500mA High PSRR LDO
- 5.0V 1A Boost Converter
- Battery & Switch

## Library data of the parts
C1 C2 C7 C13-C59 = rcl:C-EU: CAPACITOR, European symbol; SPICEPREFIX: C
HY1 HY2 = Charles:HHM22152A2: RF DIR COUPLER 450-3800MHZ 1608
IC1 = texas:TPS6120*: LOW INPUT VOLTAGE SYNCHRONOUS BOOST CONVERTER WITH 1.3-A SWITCHES Source: http://focus.ti.com/lit/ds/symlink/tps61200.pdf; MPN: TPS61202DRCR; OC_FARNELL: unknown; OC_NEWARK: 37M0069
J1 = SparkFun-Connectors:CONN_10: Multi connection point. Often used as Generic Header-pin footprint for 0.1 inch spaced/style header connections On any of the 0.1 inch spaced packages, you can populate with these: Break Away Headers - Straight <https://www.sparkfun.com/products/116> (PRT-00116) Break Away Male Headers - Right Angle <https://www.sparkfun.com/products/553> (PRT-00553) Female Headers <https://www.sparkfun.com/products/115> (PRT-00115) Break Away Headers - Machine Pin <https://www.sparkfun.com/products/117> (PRT-00117) Break Away Female Headers - Swiss Machine Pin <https://www.sparkfun.com/products/743> (PRT-00743) Arduino Stackable Header - 10 Pin <https://www.sparkfun.com/products/11376> (PRT-11376) For SCREWTERMINALS and SPRING TERMINALS visit here: Screw Terimnals on SparkFun.com <https://www.sparkfun.com/search/results?term=Screw+Terminals> (5mm/3.5mm/2.54mm spacing) This device is also useful as a general connection point to wire up your design to another part of your project. Our various solder wires solder well into these plated through hole pads. Hook-Up Wire - Assortment (Stranded, 22 AWG) <https://www.sparkfun.com/products/11375> (PRT-11375) Hook-Up Wire - Assortment (Solid Core, 22 AWG) <https://www.sparkfun.com/products/11367> (PRT-11367) View the entire wire category on our website here <https://www.sparkfun.com/categories/141> Special notes: Molex polarized connector foot print use with SKU : PRT-08231 with associated crimp pins and housings. 1MM SMD Version SKU: PRT-10208 NOTES ON THE VARIANTS LOCK and LOCK_LONGPADS... This footprint was designed to help hold the alignment of a through-hole component (i.e. 6-pin header) while soldering it into place. You may notice that each hole has been shifted either up or down by 0.005 of an inch from it's more standard position (which is a perfectly straight line). This slight alteration caused the pins (the squares in the middle) to touch the edges of the holes. Because they are alternating, it causes a "brace" to hold the component in place. 0.005 has proven to be the perfect amount of "off-center" position when using our standard breakaway headers. Although looks a little odd when you look at the bare footprint, once you have a header in there, the alteration is very hard to notice. Also,if you push a header all the way into place, it is covered up entirely on the bottom side.; PROD_ID: CONN-11563
J2 = Tag-Connect-Footprints:TC2030: TAG-CONNECT ICSP Connector Manufacturer: Tag-Connect <http://www.tag-connect.com> Cable for easy In-Circuit Serial Programming. Designed for Microchip ICD2, suitable for many others. Two variants - one "with legs" (for hands-free fit on PCB) and another "without legs" for quick programming. PAD Description 1 MCLR/Vpp 2 Vdd 3 GND 4 PGD (ISPDAT) 5 PGC (ISPCLK) 6 nc (used for LVP) ©2009 ROFA.cz - modified and updated by Robert Darlington ‹rdarlington@gmail.com›
J3 = ASSIST:JST_2PIN_PH: SMD Right Angle 2 pin 2mm JST Connector. Typically used for battery connectors. https://www.digikey.com/product-detail/en/jst-sales-america-inc/S2B-PH-SM4-TB-LF-SN/455-1749-1-ND/926846
J4 = ASSIST:MICRO_USB_VERTICAL: Micro USB connector (vertical) - This connector comes in the B form factor.; DIGI#: 732-5958-1-ND; MANF#: 614105150721; URL: https://www.digikey.com/product-detail/en/wurth-electronics-inc/614105150721/732-5958-1-ND/5047553
L1-L8 L12 L13 = Charles:INDUCTOR: Chip Inductor
L9 = Charles:VLCF4020T-2R2N1R7: FIXED IND 2.2UH 1.72A 59 MOHM
L10 L11 = Charles:BLM18EG221SN1D: Ferrite Bead; COPYRIGHT: Copyright C 2015 Accelerated Designs. All rights reserved; MANUFACTURER_PART_NUMBER: BLM18EG221SN1D; VENDOR: MURATA
LED1-LED8 = led:LED: LED OSRAM: - CHIPLED LG R971, LG N971, LY N971, LG Q971, LY Q971, LO R971, LY R971 LH N974, LH R974 LS Q976, LO Q976, LY Q976 LO Q996 - Hyper CHIPLED LW Q18S LB Q993, LB Q99A, LB R99A - SideLED LS A670, LO A670, LY A670, LG A670, LP A670 LB A673, LV A673, LT A673, LW A673 LH A674 LY A675 LS A676, LA A676, LO A676, LY A676, LW A676 LS A679, LY A679, LG A679 - Hyper Micro SIDELED® LS Y876, LA Y876, LO Y876, LY Y876 LT Y87S - SmartLED LW L88C, LW L88S LB L89C, LB L89S, LG L890 LS L89K, LO L89K, LY L89K LS L896, LA L896, LO L896, LY L896 - TOPLED LS T670, LO T670, LY T670, LG T670, LP T670 LSG T670, LSP T670, LSY T670, LOP T670, LYG T670 LG T671, LOG T671, LSG T671 LB T673, LV T673, LT T673, LW T673 LH T674 LS T676, LA T676, LO T676, LY T676, LB T676, LH T676, LSB T676, LW T676 LB T67C, LV T67C, LT T67C, LS T67K, LO T67K, LY T67K, LW E67C LS E67B, LA E67B, LO E67B, LY E67B, LB E67C, LV E67C, LT E67C LW T67C LS T679, LY T679, LG T679 LS T770, LO T770, LY T770, LG T770, LP T770 LB T773, LV T773, LT T773, LW T773 LH T774 LS E675, LA E675, LY E675, LS T675 LS T776, LA T776, LO T776, LY T776, LB T776 LHGB T686 LT T68C, LB T68C - Hyper Mini TOPLED® LB M676 - Mini TOPLED Santana® LG M470 LS M47K, LO M47K, LY M47K Source: http://www.osram.convergy.de LUXEON: - LUMILED® LXK2-PW12-R00, LXK2-PW12-S00, LXK2-PW14-U00, LXK2-PW14-V00 LXK2-PM12-R00, LXK2-PM12-S00, LXK2-PM14-U00 LXK2-PE12-Q00, LXK2-PE12-R00, LXK2-PE12-S00, LXK2-PE14-T00, LXK2-PE14-U00 LXK2-PB12-K00, LXK2-PB12-L00, LXK2-PB12-M00, LXK2-PB14-N00, LXK2-PB14-P00, LXK2-PB14-Q00 LXK2-PR12-L00, LXK2-PR12-M00, LXK2-PR14-Q00, LXK2-PR14-R00 LXK2-PD12-Q00, LXK2-PD12-R00, LXK2-PD12-S00 LXK2-PH12-R00, LXK2-PH12-S00 LXK2-PL12-P00, LXK2-PL12-Q00, LXK2-PL12-R00 Source: www.luxeon.com KINGBRIGHT: KA-3528ASYC Source: www.kingbright.com
Q1 = Charles:BSS138: MOSFET N-CH 50V 220MA
R2-R19 = rcl:R-US_: RESISTOR, American symbol; SPICEPREFIX: R
S1 S5 = Charles:KMR731NG: Tactile Switch SPST-NO Top Actuated Surface Mount
S3 S4 = ASSIST:SPDT_THRU
U2 = Charles:STM32L052K6T6: ARM® Cortex®-M0+ STM32L0 Microcontroller IC 32-Bit 32MHz 32KB (32K x 8) FLASH 32-LQFP (7x7)
U5 U7 = Charles:DUPLEXER_: Taiyo Yuden SAW Duplexer for Mobile Communications; BAND: 12; FREQ: 699-746MHz
U12 U13 U16 U18 = BGA7L1N6:BGA7L1N6: BGA7L1N6 Silicon Germanium Low Noise Amplifier for LTE, Insertion Power Gain:13.3dB INF-PG-TSNP-6-2
U14 U17 = Charles:TQM879028: Qorvo 0.6-4 GHz 1/2 W Digital Variable Gain Amplifier. Variable gain from 0.5 dB to 32 dB at 2.14 GHz, +44 dBm output IP3, and +27.5 dBm P1dB, 230 mA current from a 5V supply.
U15 U19 = BGS12SN6:BGS12SN6: BGS12SN6 Wideband RF SPDT Switch INF-PG-TSNP-6-2
U20 U21 = Charles:MAX4003EUA+T; BUILT_BY: EMA_UL_Team; MANUFACTURER_PART_NUMBER: max4003eua+T; VENDOR: Maxim Integrated Products
U22 = Charles:LP5912: 500-mA Low-Noise, Low-IQ LDO, High PSRR
X1 X2 = Charles:SMACONNECTOR: SMA Connector DIP SMA Connector, 50 Ohm (4UConnector: 07259)

## Net classes
0 STANDARD: clearance 0.102 mm
1 GND: clearance 0.102 mm
2 DIFF: width 0.305 mm, clearance 0.203 mm

## Board
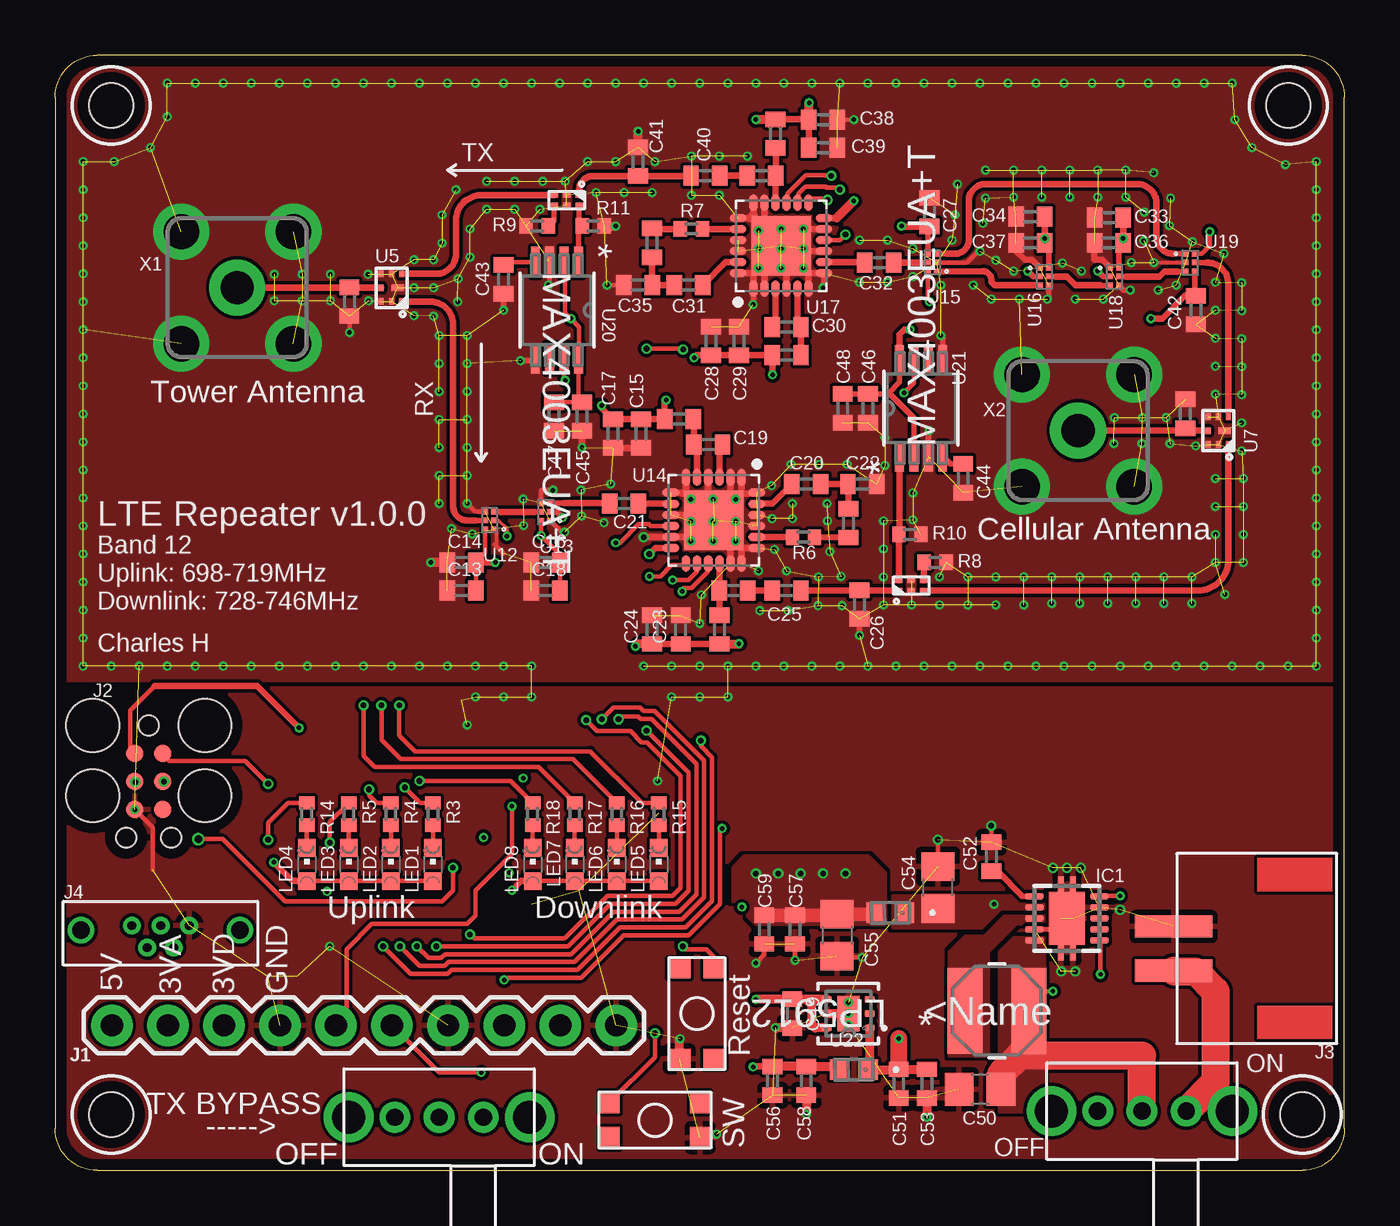
[diagram p6: board, top side]
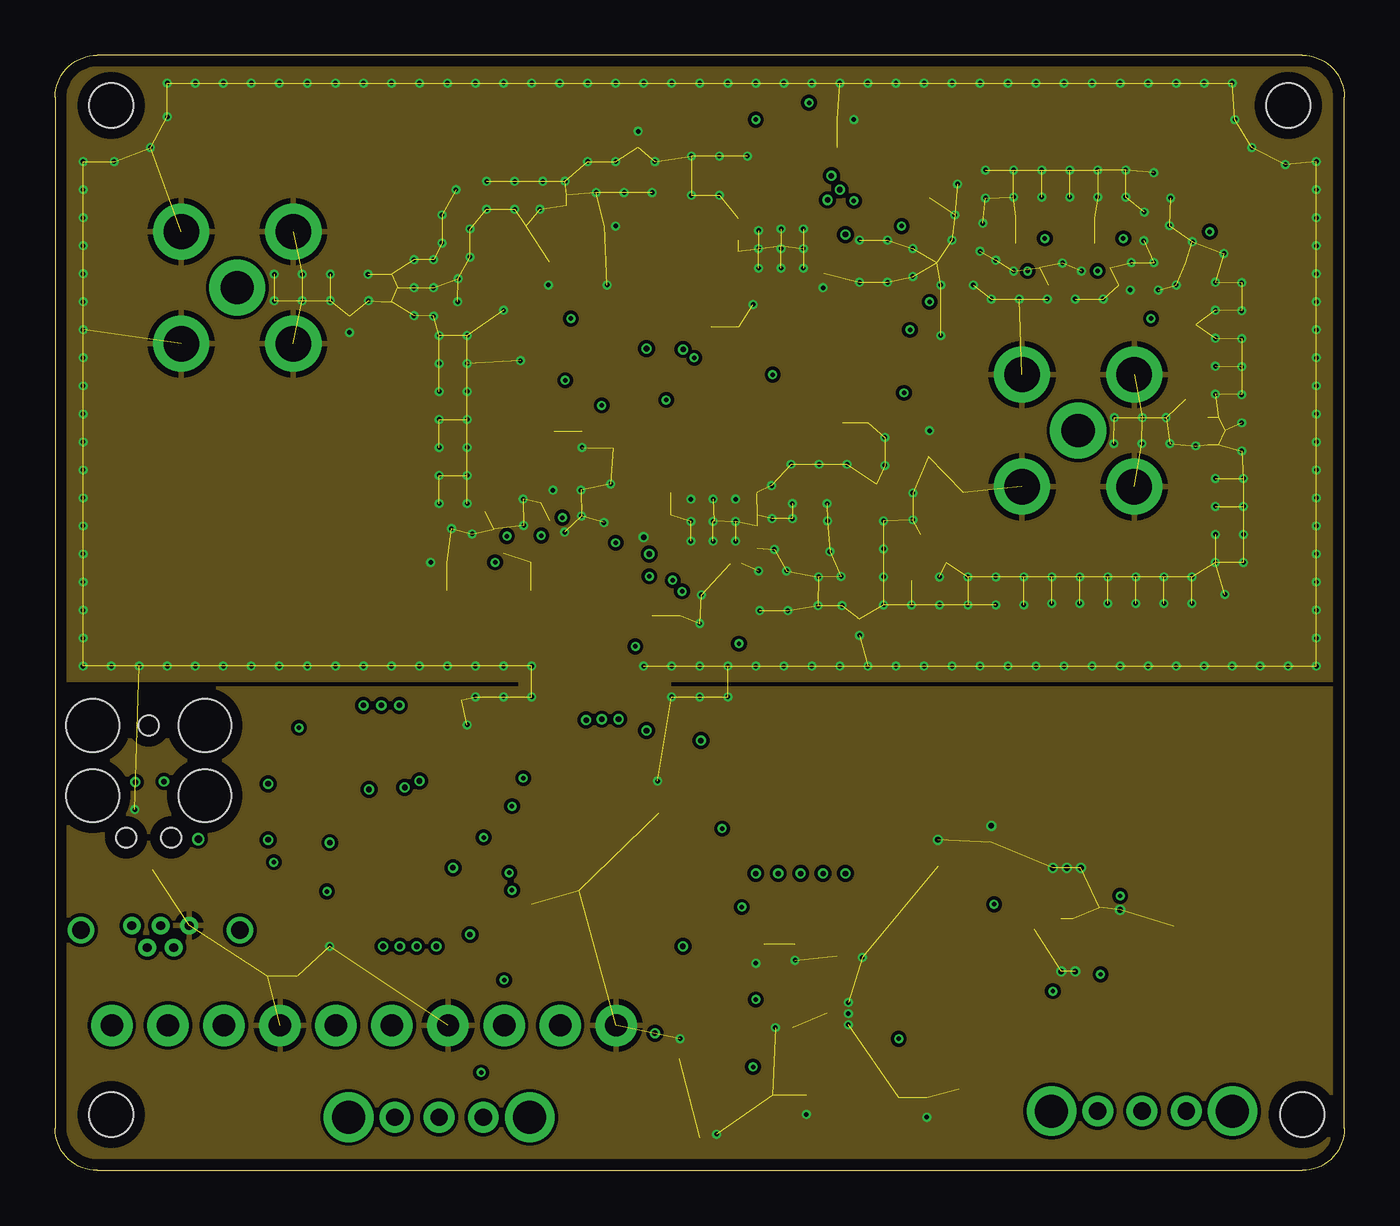
[diagram p7: board, inner layer Route2]
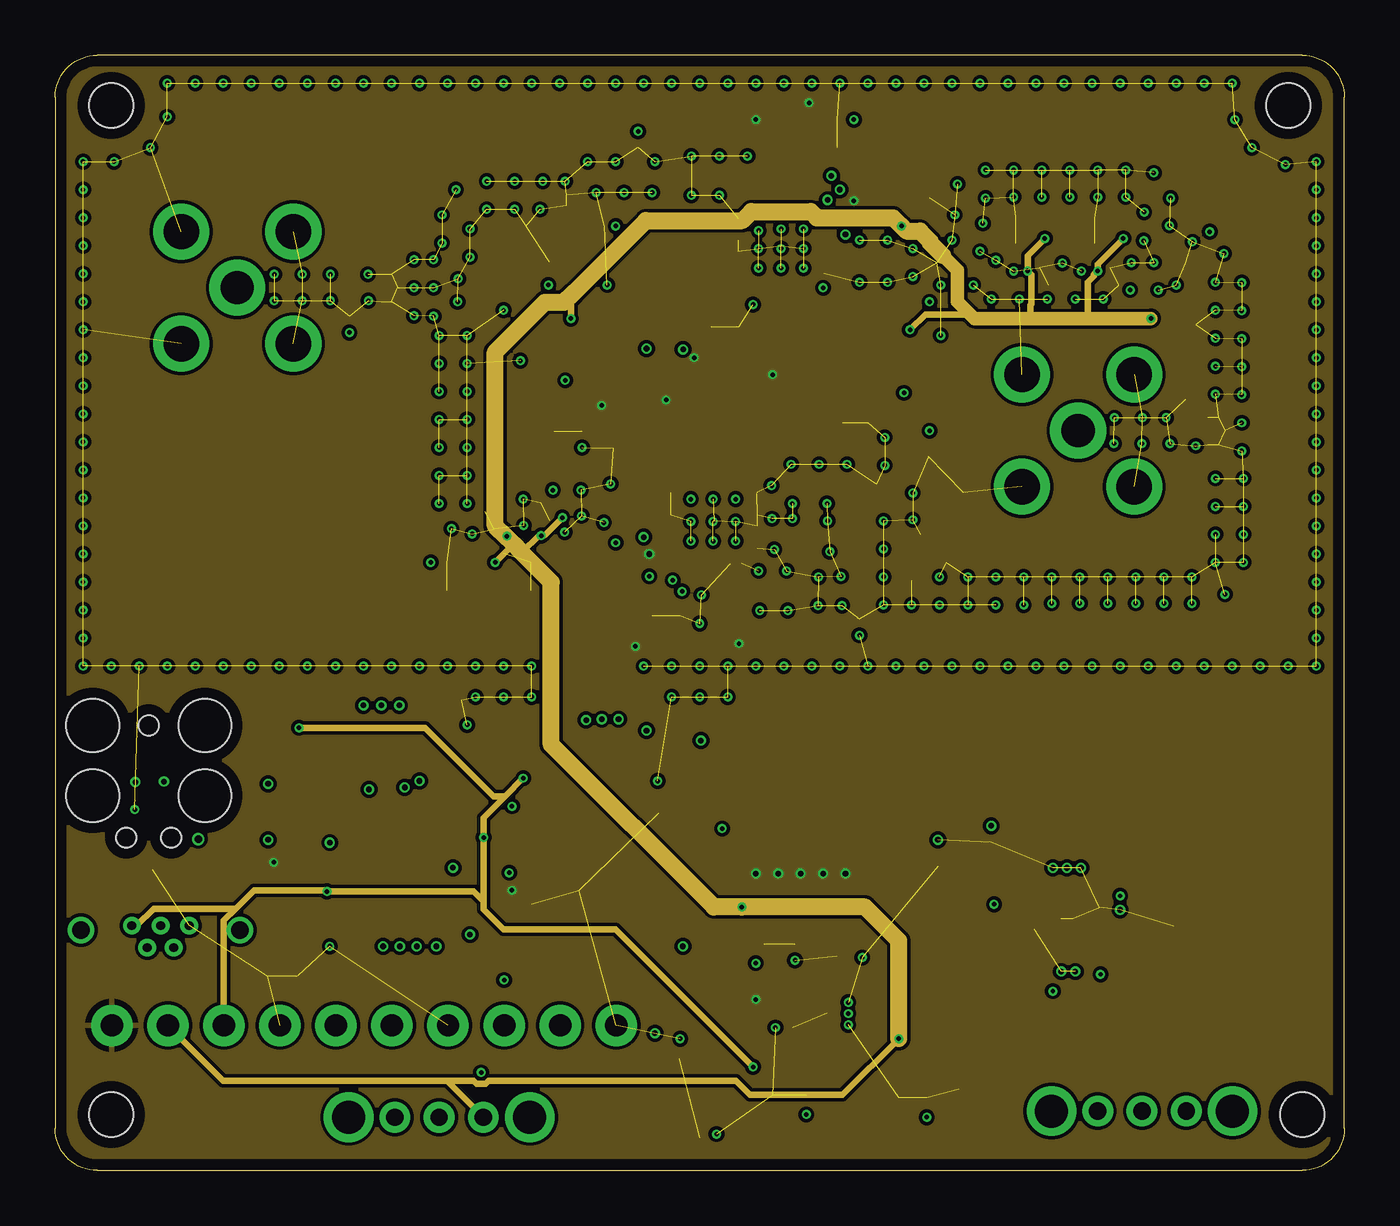
[diagram p8: board, inner layer Route15]
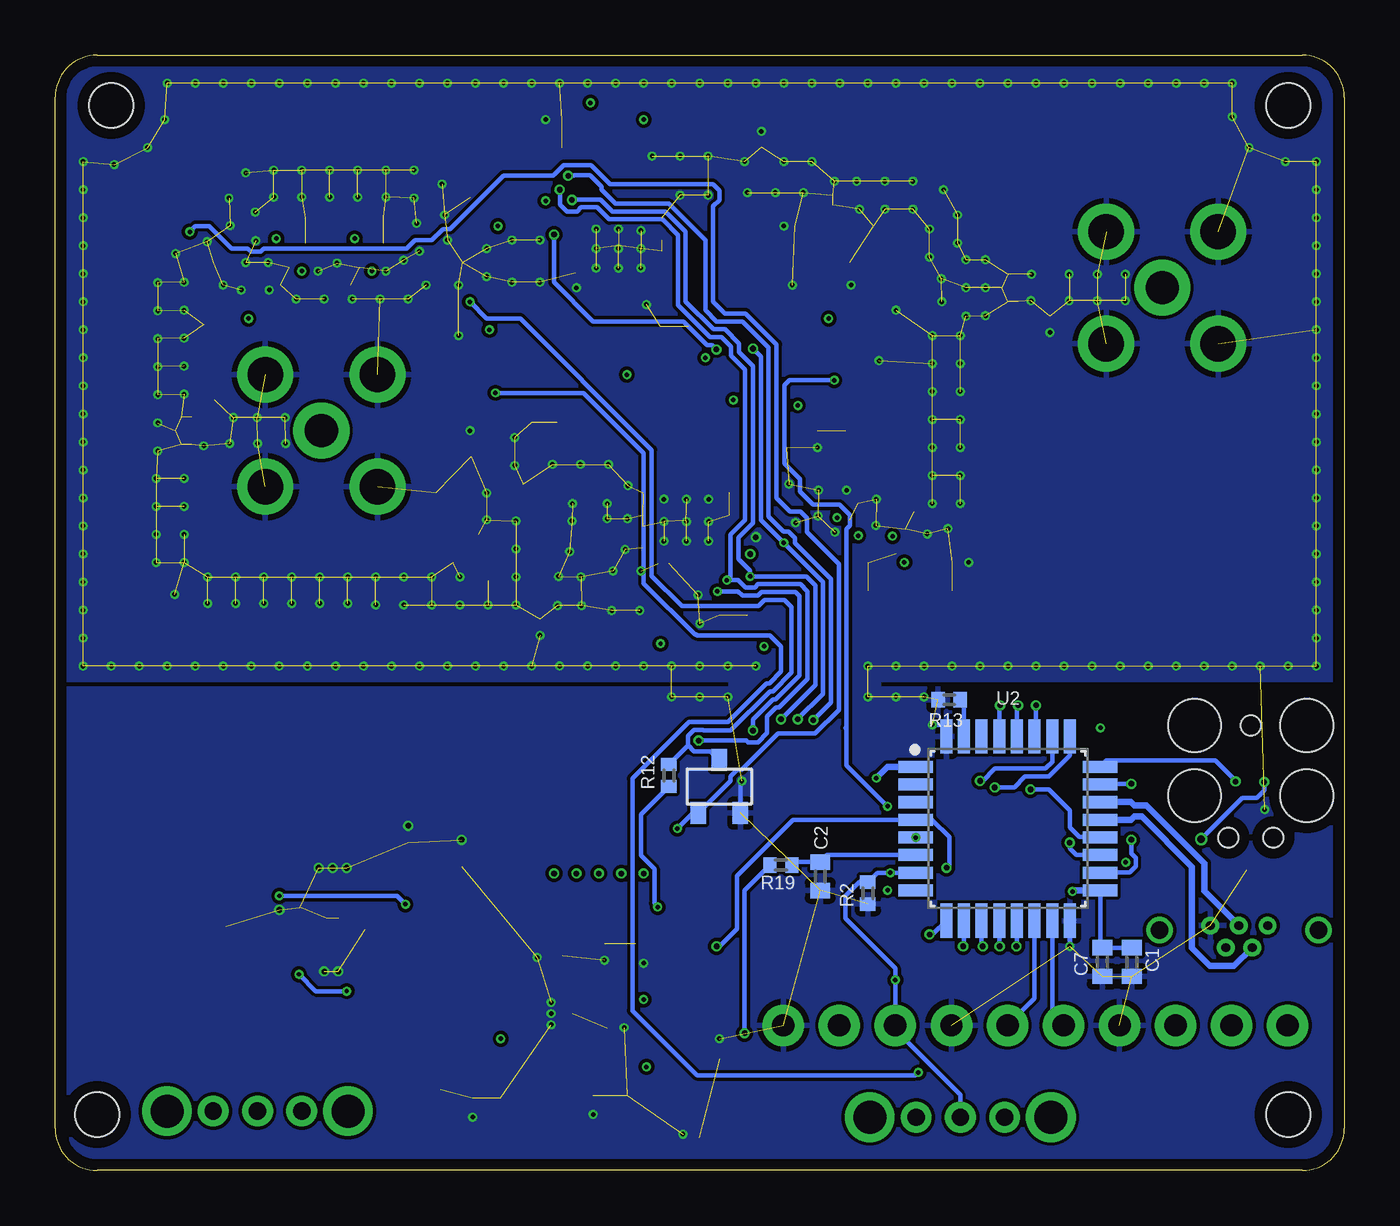
[diagram p9: board, bottom side, seen from below]

Size 58.42 x 50.55 mm. Coordinates in mm from the lower left corner, seen from the top.
Outline: 1.91,0 56.52,0 arc90 58.42,1.91 58.42,48.64 arc90 56.52,50.55 1.91,50.55 arc90 0,48.64 0,1.91 arc90 1.91,0
Copper layers (1+2*15+16): Top 0.035mm / dielectric 1.5mm / Route2 0.035mm / dielectric 0.15mm / Route15 0.035mm / dielectric 0.2mm / Bottom 0.035mm
Design rules "default *": minimum track width 6mil, minimum drill 4mil, track to track 6mil, track to pad 6mil, pad to pad 3mil, via to via 6mil, smd to smd 3mil, copper to edge 20mil, drill to drill 3mil, minimum pad ring 8mil, minimum via ring 4mil, stop-mask expansion 4mil, vias tented up to drill 0mil, thermal gap 10mil
Holes 2 mm at 2.54,2.54 56.52,2.54 2.54,48.26 55.88,48.26
tKeepout: area 30.8,43 to 31.6,43.2; area 32.2,43.3 to 32.3,44.1

### Footprints (pad centres in the part's own frame; a part is rotated, then mirrored left to right if it is on the bottom)
C0402 = smd 0.7 x 0.9: 1 -0.65,0; 2 0.65,0
C0805 = smd 1.3 x 1.5: 1 -0.95,0; 2 0.95,0
HHM22152A2 = smd 0.35 x 0.225: P$1 0,0; P$2 0.57,0; P$3 1.14,0; P$4 1.14,0.445; P$5 0.57,0.445; P$6 0,0.445
S-PDSO-N10 = smd 0.28 x 0.85: 1 -1,-1.475; 2 -0.5,-1.475; 3 0,-1.475; 4 0.5,-1.475; 5 1,-1.475; 6 1,1.475; 7 0.5,1.475; 8 0,1.475; 9 -0.5,1.475; 10 -1,1.475 | smd 2.4 x 1.65: PP 0,0 | smd 3.8 x 0.28: PP@1 0,0.275; PP@2 0,-0.275
1X10 = drill 1.016 pad 1.88: 1 0,0; 2 2.54,0; 3 5.08,0; 4 7.62,0; 5 10.16,0; 6 12.7,0; 7 15.24,0; 8 17.78,0; 9 20.32,0; 10 22.86,0
TC2030-MCP = smd 0.787 x 0.787: 1 1.27,-0.635; 2 1.27,0.635; 3 2.54,-0.635; 4 2.54,0.635; 5 3.81,-0.635; 6 3.81,0.635 | hole 0.889: 0,0; 5.08,-1.016; 5.08,1.016 | hole 2.375: 0,2.54; 0,-2.54; 3.175,-2.54; 3.175,2.54
JST_2PIN_PH = smd 3.5 x 1: 1 3.8,1.1; 2 3.8,-0.9
MICRO_USB_VERTICAL = drill 0.4: 1 -1.3,0; 2 -0.6,-1; 3 0,0; 4 0.6,-1; 5 1.3,0 | drill 0.8: 6 -3.6,-0.2; 7 3.6,-0.2
0402 = smd 0.7 x 0.9: 1 -0.65,0; 2 0.65,0
IND_4028 = smd 1.6 x 3.9: 1 -1.45,0; 2 1.45,0
IND_BLM18_0603 = smd 0.813 x 0.94: 1 -0.673,0; 2 0.673,0
CHIPLED_0603 = smd 0.8 x 0.8: A 0,-0.75; C 0,0.75
SOT23-3 = smd 0.7 x 1: 1 -0.95,-1.2; 2 0.95,-1.2; 3 0,1.2
R0402 = smd 0.6 x 0.7: 1 -0.5,0; 2 0.5,0
KMR731NG = smd 0.9 x 1: P$1 -2.05,0.8; P$2 2.05,0.8; P$3 2.05,-0.8; P$4 -2.05,-0.8
SPDT_THRU = drill 0.787 pad 1.397: 1 -2.007,0; 2 0,0; 3 2.007,0 | drill 1.499: A1 -4.102,0; A2 4.102,0
QFP80P900X900X160-32 = smd 1.559 x 0.547: 1 -4.178,2.8; 2 -4.178,2; 3 -4.178,1.2; 4 -4.178,0.4; 5 -4.178,-0.4; 6 -4.178,-1.2; 7 -4.178,-2; 8 -4.178,-2.8; 17 4.178,-2.8; 18 4.178,-2; 19 4.178,-1.2; 20 4.178,-0.4; 21 4.178,0.4; 22 4.178,1.2; 23 4.178,2; 24 4.178,2.8 | smd 0.547 x 1.559: 9 -2.8,-4.178; 10 -2,-4.178; 11 -1.2,-4.178; 12 -0.4,-4.178; 13 0.4,-4.178; 14 1.2,-4.178; 15 2,-4.178; 16 2.8,-4.178; 25 2.8,4.178; 26 2,4.178; 27 1.2,4.178; 28 0.4,4.178; 29 -0.4,4.178; 30 -1.2,4.178; 31 -2,4.178; 32 -2.8,4.178
TAIYO_YUDEN_DUPLEX_1.8X1.4 = smd 0.3 x 0.23: 1 -0.625,-0.46; 3 0.625,-0.46; 4 0.625,0; 5 0.625,0.46; 6 0,0.46; 7 -0.625,0.46; 8 -0.625,0 | smd 0.3 x 0.575: 2 0,-0.287
INF-PG-TSNP-6-2 = smd 0.25 x 0.25: 1 -0.2,0.4; 2 -0.2,0; 3 -0.2,-0.4; 4 0.2,-0.4; 5 0.2,0; 6 0.2,0.4
QFN50P400X400X100-25T270N = smd 0.75 x 0.38: 1 -1.95,1.25; 2 -1.95,0.75; 3 -1.95,0.25; 4 -1.95,-0.25; 5 -1.95,-0.75; 6 -1.95,-1.25; 13 1.95,-1.25; 14 1.95,-0.75; 15 1.95,-0.25; 16 1.95,0.25; 17 1.95,0.75; 18 1.95,1.25 | smd 0.38 x 0.75: 7 -1.25,-1.95; 8 -0.75,-1.95; 9 -0.25,-1.95; 10 0.25,-1.95; 11 0.75,-1.95; 12 1.25,-1.95; 19 1.25,1.95; 20 0.75,1.95; 21 0.25,1.95; 22 -0.25,1.95; 23 -0.75,1.95; 24 -1.25,1.95 | smd 2.7 x 2.7: 25 0,0
21-0036K = smd 1.372 x 0.406: 1 -2.184,0.975; 2 -2.184,0.325; 3 -2.184,-0.325; 4 -2.184,-0.975; 5 2.184,-0.975; 6 2.184,-0.325; 7 2.184,0.325; 8 2.184,0.975
DRV0006A = smd 0.457 x 0.305: 1 -0.975,0.65; 2 -0.975,0; 3 -0.975,-0.65; 4 0.975,-0.65; 5 0.975,0; 6 0.975,0.65 | smd 0.991 x 1.6: 7 0,0
SMA_DIP = drill 1.5 pad 2.54: ANTENNA 0,0 | drill 1.6 pad 2.54: GND1 -2.54,2.54; GND2 2.54,2.54; GND3 -2.54,-2.54; GND4 2.54,-2.54

### Placement (x,y rotation side)
C1  9.63,9.45 270 bottom
C2  23.75,13.34 270 bottom
C7  10.97,9.45 90 bottom
C13  18.41,26.29 0 top
C14  18.41,27.56 0 top
C15  26.54,33.4 90 top
C16  22.22,27.56 0 top
C17  25.27,33.4 90 top
C18  22.22,26.29 0 top
C19  29.59,32.89 0 top
C20  34.04,31.11 180 top
C21  25.78,30.23 0 top
C22  36.58,31.11 0 top
C23  28.35,24.51 90 top
C24  27.05,24.51 90 top
C25  33.15,26.29 0 top
C26  36.45,25.65 270 top
C27  39.62,43.43 270 top
C28  29.72,37.59 270 top
C29  30.99,37.59 270 top
C30  33.15,38.23 180 top
C31  28.7,40.13 0 top
C32  37.34,41.15 180 top
C33  47.75,43.18 0 top
C34  44.2,43.23 0 top
C35  26.42,40.13 180 top
C36  47.75,42.04 0 top
C37  44.2,42.04 0 top
C38  34.8,47.62 0 top
C39  34.8,46.35 0 top
C40  29.46,45.09 180 top
C41  26.42,45.72 90 top
C42  51.69,38.99 90 top
C43  20.32,40.39 270 top
C44  41.15,31.37 270 top
C45  23.88,34.16 270 top
C46  36.83,34.54 270 top
C47  22.61,34.16 270 top
C48  35.69,34.54 270 top
C49  33.4,7.11 270 top
C50  41.91,3.68 180 top
C51  38.23,3.94 270 top
C52  42.42,14.22 90 top
C53  39.5,3.94 270 top
C54  40.01,12.83 90 top
C55  35.43,10.67 270 top
C56  32.51,4.06 270 top
C57  33.53,10.92 270 top
C58  34.04,4.06 270 top
C59  32.13,10.92 270 top
HY1  38.23,26.29 0 top
HY2  23.75,44.2 180 top
IC1  45.85,11.43 270 top
J1  2.57,6.58 0 top
J2  4.24,20.17 270 top
J3  54.48,10.16 180 top
J4  4.78,11.1 0 top
L1  28.27,34.06 0 top
L2  35.94,29.34 90 top
L3  30.1,24.51 270 top
L4  30.73,26.29 0 top
L5  33.15,36.96 0 top
L6  27.05,42.04 270 top
L7  32.64,46.99 90 top
L8  32,45.09 180 top
L9  42.67,7.24 0 top
L10  36.2,4.57 180 top
L11  37.85,11.68 180 top
L12  13.34,39.37 90 top
L13  51.21,34.29 270 top
LED1  17.12,13.87 0 top
LED2  15.21,13.87 0 top
LED3  13.31,13.87 0 top
LED4  11.4,13.87 0 top
LED5  27.36,13.87 0 top
LED6  25.45,13.87 0 top
LED7  23.55,13.87 0 top
LED8  21.64,13.87 0 top
Q1  28.32,17.4 0 bottom
R2  21.59,12.57 90 bottom
R3  17.12,16.15 270 top
R4  15.21,16.15 270 top
R5  13.31,16.15 270 top
R6  33.91,28.7 180 top
R7  28.83,42.67 0 top
R8  39.88,27.56 0 top
R9  21.84,42.8 180 top
R10  38.73,28.83 0 top
R11  24.38,42.8 0 top
R12  30.61,17.91 90 bottom
R13  17.91,21.34 180 bottom
R14  11.4,16.15 270 top
R15  27.36,16.15 270 top
R16  25.45,16.15 270 top
R17  23.55,16.15 270 top
R18  21.64,16.15 270 top
R19  25.53,13.84 180 bottom
S1  29.08,7.11 270 top
S3  17.4,2.41 0 top
S4  49.25,2.69 0 top
S5  27.18,2.29 0 top
U2  15.24,15.49 0 bottom
U5  15.24,40.01 90 top
U7  52.7,33.53 90 top
U12  19.68,29.46 180 top
U13  22.22,29.84 180 top
U14  29.84,29.46 270 top
U15  39.75,41.15 180 top
U16  44.83,40.51 0 top
U17  32.89,41.91 90 top
U18  48.01,40.51 0 top
U19  51.44,41.15 0 top
U20  22.73,38.99 270 top
U21  39.24,34.54 90 top
U22  35.94,7.11 180 top
X1  8.25,40.01 270 top
X2  46.35,33.53 180 top

### Tracks (layer width: path | path; a pad name or v marks a point on that pad's centre or on a via)
+3V0_ANALOG  (via drill 0.2 pad 0.15)
  Top 0.152: v20.47,28.75 20.47,29.08 20.09,29.46 U12.2
  Top 0.203: U12.6 19.48,27.98 C14.2 C13.2 | U13.6 v22.02,28.77 22.88,27.93 C16.2 C18.2 | C47.1 C45.1 23.71,34.98 U20.8 23.75,36.85 23.75,38.23 v23.37,38.61 23.11,38.86 23.11,41.12 U20.2 | L10.1 36.92,4.62 36.92,4.75
  Top 0.254: U18.6 48.21,41.84 C36.2 | U16.6 45.03,41.85 C37.2 | U19.4 51.63,39.64 C42.2 | U18.2 47.5,40.51 v47.24,40.77 | U16.2 44.32,40.51 v44.07,40.77 | U15.4 39.55,42.71 C27.2 | C48.1 C46.1 37.73,35.19 37.78,35.24 | U21.8 38.27,35.73 37.78,35.24 | U21.2 38.92,34.11 37.78,35.24 | U13.2 22.73,29.84 v22.99,29.59
  Top 0.305: 51.63,39.64 51.2,39.64 50.16,38.61 v49.66,38.61 | C36.2 v48.4,42.24 C33.2 | v44.85,42.24 C37.2 C34.2 | U21.8 38.27,37.89 38.48,38.1 v38.73,38.1 | C14.2 v19.94,27.56 | C27.2 38.37,42.78 v38.35,42.8
  Top 0.406: C51.1 38.2,4.56 38.18,4.57 | 36.92,4.75 U22.1 | C51.1 C53.1 | L10.1 38.21,4.57 C51.1
  Top 0.762: C51.1 v38.23,5.97
  Route15 0.203: v20.47,28.75 20.47,28.73 20.45,28.7
  Route15 0.254: v22.99,29.59 22.17,28.77 v22.02,28.77
  Route15 0.305: 46.79,38.61 46.79,40.26 47.07,40.54 47.07,40.59 v47.24,40.77 47.24,41.08 v48.4,42.24 | 44.2,38.61 44.2,39.22 44.25,39.27 44.25,40.59 v44.07,40.77 44.07,41.46 v44.85,42.24 | v38.73,38.1 39.43,38.8 41.46,38.8 | v19.94,27.56 20.76,28.38 | 21.14,28 21.92,28.77 v22.02,28.77 | v23.37,38.61 23.37,39.65 23.48,39.77 | J1.2 7.62,4.06 17.75,4.06 | S3.3 17.75,4.06 | 17.75,4.06 18.97,4.06 19.09,3.94 19.51,3.94 19.64,4.06 30.86,4.06 31.5,3.43 35.69,3.43 v38.23,5.97
  Route15 0.61: 40.21,41.48 40.89,40.8 40.89,39.37 41.46,38.8 41.66,38.61 44.2,38.61 46.79,38.61 v49.66,38.61
  Route15 0.762: v38.23,5.97 38.23,10.41 36.7,11.94 v31.11,11.94 29.84,11.94 22.48,19.3 22.48,26.67 21.14,28 20.76,28.38 20.45,28.7 19.94,29.21 19.94,37.08 22.2,39.34 23.06,39.34 23.48,39.77 26.77,43.05 31.14,43.05 31.55,43.46 34.23,43.46 34.52,43.18 37.97,43.18 v38.35,42.8 38.58,42.57 39.19,42.57 39.65,42.11 39.65,42.04 40.21,41.48
  Bottom 0.203: R12.1 31.88,16.14 31.88,14.27 31.27,13.66 31.27,12.12 31.11,11.97 v31.11,11.94
+3V0_DIGITAL  (via drill 0.2 pad 0.15)
  Top 0.203: 3.53,18.9 J2.1 3.4,19.1 3.4,20.85 4.52,21.96
  Top 0.305: C56.1 31.64,4.71 v31.62,4.7 | 4.52,21.96 9.15,21.96 v11.05,20.07
  Top 0.406: C58.1 34.02,4.7 34.15,4.57 | C58.1 C56.1 | C58.1 35.38,4.71 L10.2
  Route15 0.305: 19.42,12.19 19.42,11.82 20.32,10.92 25.4,10.92 v31.62,4.7 | 19.42,12.19 U2.5 19.42,15.99 20.38,16.95 | 19.42,12.19 18.96,12.65 v12.32,12.65 12.27,12.7 9.02,12.7 8.19,11.87 8.18,11.86 | v21.21,17.78 20.38,16.95 | v11.05,20.07 16.76,20.07 19.88,16.95 20.38,16.95 | J1.3 7.65,11.33 8.18,11.86 | J4.1 3.7,11.1 4.46,11.86 8.18,11.86
  Bottom 0.203: 10.99,10.08 C7.2 10.8,10.1 | 10.8,10.1 C1.1 | U2.17 11.06,10.37 10.8,10.1
  Bottom 0.305: U2.17 12.27,12.69 v12.32,12.65 | U2.1 20.7,18.29 v21.21,17.78
  other vias: 19.42,15.09
+5V0  (via drill 0.2 pad 0.15, 0.25)
  Top 0.203: LED4.A LED3.A LED2.A LED1.A | LED8.A LED7.A LED6.A LED5.A
  Top 0.305: C24.1 C23.1 28.37,23.86 L3.2 | L7.2 34.13,47.64 C38.1 C39.1 | U14.12 27.2,28.21 v26.92,27.94 | v28.96,36.83 29.07,36.94 C28.2 C29.2 32.5,36.94 L5.1 32.51,36.94 v32.51,36.07 | v27.69,34.92 27.62,34.86 L1.1 C15.2 C17.2 24.77,34.56 v24.77,34.67 | LED8.A 21.12,13.12 v20.7,12.7 | LED4.A 10.76,13.12 v9.91,13.97 | U17.12 35.41,43.16
  Top 0.406: U22.6 34.43,6.46 34.29,6.6 34.29,7.49 34.02,7.76 | 34.02,7.76 C49.1 33.39,7.75 v31.75,7.75 | U22.4 34.02,7.76 | L3.2 30.97,23.86 v30.99,23.88 | C24.1 26.4,23.86 v26.29,23.75 | L7.2 32.62,47.62 v31.75,47.62 | C38.1 34.15,48.37 v34.16,48.39 | 35.41,43.16 v36.2,43.94
  Top 0.61: C59.1 C57.1 35.39,11.57 C55.1 37.11,11.62
  other vias: 31.75,13.46 32.77,13.46 33.78,13.46 34.8,13.46 35.81,13.46
  pour Route15 (rank 2): -2.79,-4.83 61.72,-4.83 61.72,52.58 -2.79,52.58
  pour Top (no thermals): 30.73,12.19 31.75,11.18 37.59,11.18 37.59,13.46 36.83,14.22 31.24,14.22 30.73,13.72
CELL_ANT
  Top 0.305: X2.ANTENNA 51.09,33.53 arc-90 L13.2 arc-90 51.32,33.53 U7.6
GND  (via drill 0.2 pad 0.15, 0.25)  (438 unrouted)
  Top 0.152: U19.2 v49.78,41.15 | U12.1 20,28.95 20,28.28 | C52.2 v42.42,15.62 | C54.2 v40.01,14.99
  Top 0.203: U20.3 22.41,40.19 v22.35,40.13 | C35.2 v25.02,40.13 | C38.2 v36.2,47.62 | L12.1 v13.34,37.97 | C55.2 35.5,9.65 v36.58,9.65 | C57.2 v33.53,9.53 | C59.2 32.13,9.78 v31.75,9.4 | v35.94,7.62 U22.7 v35.94,6.6 | J2.5 4.42,15.54 4.42,13.61 | U15.2 41.33,41.15 41.83,41.66 v41.91,41.66 | U13.4 22.02,30.81 22.05,30.84 v22.55,30.84 | 29.59,30.66 v29.82,30.43 | IC1.4 45.07,10.93 IC1.PP@2 | U13.1 22.94,28.93 v23.09,28.93 | U12.4 19.03,29.86 v18.67,30.23 | 19.91,28.37 20,28.28 20.32,27.96
  Top 0.254: U20.5 21.66,36.7 v21.08,36.7 | C43.2 v20.32,38.99 | U17.1 31.64,39.26 v31.62,39.24 | U17.7 34.84,40.05 v34.8,40.01 | U21.5 40.22,37.76 v40.13,37.85 | U21.3 39.57,33.47 v39.62,33.53 | C26.2 v36.45,24.26 | 31.64,43.03 31.76,42.91 | U18.1 47.44,41.27 | U18.4 48.42,39.9 v48.72,39.9 | U16.4 45.03,39.57 v44.96,39.5
  Top 0.305: C17.1 C15.1 | v26.67,28.7 27.88,28.7 U14.11 28.61,28.71 | U14.7 28.38,30.71 28.4,30.69 28.54,30.69 | 28.54,30.69 28.52,30.71 28.59,30.79 U14.6 | 28.54,30.69 v28.8,30.43 | U14.1 31.09,30.69 31.77,30.69 | U14.2 30.59,30.67 | U14.19 31.15,28.21 v30.84,28.52 31.09,28.27 U14.18 | U14.17 30.59,28.28 | U17.24 31.64,40.66 | U17.1 31.64,40.66 | 31.64,40.66 v31.88,40.89 32.14,40.63 U17.2 | U17.4 33.14,40.64 v32.89,40.89 | U17.6 34.14,40.66 | U17.7 34.14,40.66 | 34.14,40.66 v33.91,40.89 | U17.9 34.03,41.66 | U17.11 33.92,42.66 | U17.17 32.14,42.86 | U17.18 31.64,43.31 31.64,43.03 | U17.19 31.5,43.16 | 47.44,41.27 47.12,41.27 47.1,41.29 C36.1 | U16.1 44.27,41.27 43.94,41.27 43.55,41.67 C37.1 | C45.2 v23.88,32.77 | U14.9 29.59,29.71 | U14.4 29.59,30.66
  Top 0.406: U22.5 U22.7 | C14.1 v17.02,27.56 | R11.2 v25.4,42.8 | C41.2 v26.42,47.09 | 31.09,30.69 v30.84,30.43 30.59,30.67 | 30.59,28.28 v30.84,28.52 | 28.61,28.71 v28.8,28.52 | 34.03,41.66 v33.91,41.78 | 33.92,42.66 v33.91,42.67 | 32.14,42.86 v31.88,42.6 31.76,42.71 31.76,42.91 | 31.5,43.16 31.64,43.31 | C49.2 32.65,6.46 v32.64,6.48 | S1.P$3 28.28,5.93 v28.32,5.97 | S5.P$3 29.39,1.65 v29.97,1.65 | C58.2 v34.04,2.54 | C53.2 v39.5,2.41 | 29.59,29.71 U14.25
  Bottom 0.203: Q1.2 27.37,17.59 v27.3,17.65 | U2.16 v12.45,10.16 | C7.1 10.99,8.81 | U2.32 18.04,20.19 v18.67,20.19
  other vias: 16.26,41.27 17.14,41.27 16.26,40.01 17.14,40.01 17.53,42.04 18.8,41.4 18.26,40.41 16.26,38.73 17.14,38.71 17.4,37.85 18.67,37.85 17.4,36.58 18.67,36.58 18.67,35.31 17.4,35.31 17.4,34.04 17.4,32.77 17.4,31.5 17.4,30.23 18.67,34.04 18.67,32.77 18.67,31.5 18.8,42.67 17.53,43.31 19.56,43.56 20.83,43.56 18.16,44.45 19.56,44.83 20.83,44.83 22.1,44.83 21.97,43.56 23.11,44.83 24.13,45.72 25.4,45.72 24.51,44.32 25.78,44.32 27.05,44.32 27.18,45.72 28.83,45.97 30.1,45.97 31.37,45.97 28.83,44.2 30.1,44.2 36.45,42.16 37.72,42.16 36.45,40.26 37.72,40.26 38.86,40.51 38.86,41.78 40.64,42.16 40.13,40.13 41.61,40.13 42.42,39.5 43.69,39.5 43.43,40.77 40.77,43.31 40.89,44.7 42.16,45.34 42.16,44.07 42.04,42.93 43.43,45.34 44.7,45.34 45.97,45.34 47.24,45.34 48.51,45.34 49.78,45.21 50.55,44.07 50.5,42.82 51.54,42.09 52.96,41.55 53.77,40.23 53.77,38.96 53.77,37.69 53.77,36.42 53.77,35.15 53.77,33.88 53.77,32.61 53.85,31.37 53.85,30.1 53.85,28.83 53.85,27.56 52.58,27.56 52.58,28.83 52.58,30.1 52.58,31.37 52.58,35.18 52.58,36.45 52.58,37.72 52.58,38.99 52.58,40.26 50.8,40.13 48.77,41.15 49.33,42.14 49.35,43.43 48.51,44.12 43.43,44.12 44.7,44.12 45.97,44.12 47.24,44.12 46.23,39.5 47.5,39.5 49.99,39.9 45.64,41.12 46.51,40.77 42.62,41.25 53.01,26.11 51.51,26.9 51.51,25.7 50.24,26.9 48.97,26.9 47.7,26.9 46.43,26.9 50.24,25.7 48.97,25.7 47.7,25.7 46.43,25.7 45.16,25.7 45.16,26.9 43.89,26.9 42.62,26.9 41.35,26.9 40.08,26.9 40.08,25.63 41.35,25.63 42.62,25.63 43.89,25.63 38.81,25.63 37.54,25.63 37.54,26.9 37.54,28.17 37.54,29.44 37.59,31.95 38.86,30.71 38.86,29.49 37.59,33.22 35.61,26.92 34.59,26.9 33.15,27.18 31.88,27.18 31.93,25.37 33.2,25.37 34.57,25.6 35.66,25.6 29.29,26.09 29.21,24.79 35,29.44 32.49,29.54 33.4,30.23 33.4,29.54 34.98,30.23 32.46,31.04 33.35,32 34.62,32 35.89,32 32.59,28.14 35.1,28.04 17.96,29.08 18.9,28.85 21.21,30.43 21.23,29.24 23.83,30.84 23.85,29.67 25.17,31.11 24.87,29.36 14.17,40.61 14.2,39.42 12.47,39.42 11.2,39.42 9.93,39.42 9.93,40.61 11.2,40.61 12.47,40.61 48.01,34.11 49.28,34.11 50.34,34.11 47.98,32.94 49.25,32.94 50.52,32.94 51.69,32.84 18.24,39.37 3.61,16.36 31.88,41.78 32.89,41.78 32.89,42.67 28.8,29.41 29.82,29.41 30.84,29.41 29.82,28.52 35.94,7.11 1.27,45.72 1.27,44.45 1.27,43.18 1.27,41.91 1.27,40.64 11.43,22.86 12.7,22.86 13.97,22.86 15.24,22.86 6.35,22.86 7.62,22.86 8.89,22.86 10.16,22.86 1.27,22.86 2.54,22.86 3.81,22.86 5.08,22.86 1.27,29.21 1.27,27.94 1.27,26.67 1.27,25.4 1.27,34.29 1.27,33.02 1.27,31.75 1.27,30.48 1.27,39.37 1.27,38.1 1.27,36.83 1.27,35.56 1.27,24.13 6.35,49.28 5.08,49.28 11.43,49.28 10.16,49.28 8.89,49.28 7.62,49.28 16.51,49.28 15.24,49.28 13.97,49.28 12.7,49.28 27.94,49.28 29.21,49.28 30.48,49.28 31.75,49.28 22.86,49.28 24.13,49.28 25.4,49.28 26.67,49.28 17.78,49.28 19.05,49.28 20.32,49.28 21.59,49.28 43.18,49.28 44.45,49.28 45.72,49.28 46.99,49.28 38.1,49.28 39.37,49.28 40.64,49.28 41.91,49.28 33.02,49.28 34.29,49.28 35.56,49.28 36.83,49.28 26.67,22.86 27.94,22.86 29.21,22.86 30.48,22.86 21.59,22.86 16.51,22.86 17.78,22.86 19.05,22.86 20.32,22.86 41.91,22.86 43.18,22.86 44.45,22.86 45.72,22.86 36.83,22.86 38.1,22.86 39.37,22.86 40.64,22.86 31.75,22.86 33.02,22.86 34.29,22.86 35.56,22.86 57.15,33.02 57.15,34.29 57.15,35.56 57.15,36.83 57.15,27.94 57.15,29.21 57.15,30.48 57.15,31.75 57.15,22.86 57.15,24.13 57.15,25.4 57.15,26.67 50.8,49.28 52.07,49.28 53.34,49.28 48.26,49.28 49.53,49.28 57.15,44.45 57.15,45.72 57.15,39.37 57.15,40.64 57.15,41.91 57.15,43.18 57.15,38.1 46.99,22.86 48.26,22.86 49.53,22.86 50.8,22.86 52.07,22.86 53.34,22.86 54.61,22.86 55.88,22.86 45.21,13.72 45.85,13.72 46.48,13.72 45.59,9.02 46.23,9.02 48.26,11.81 21.59,21.46 20.32,21.46 19.05,21.46 27.94,21.46 29.21,21.46 30.48,21.46 55.75,45.59 54.23,46.35 53.47,47.62 2.67,45.72 4.32,46.35 5.08,47.75
  pour Top (rank 2, no thermals): -1.52,22.23 60.2,22.23 60.2,51.56 -1.52,51.56
  pour Bottom (rank 2): -1.52,-1.27 -1.52,21.84 21.08,21.84 21.08,22.23 -1.52,22.23 -1.52,51.56 60.2,51.56 60.2,22.23 27.81,22.23 27.81,21.84 60.2,21.84 60.2,-1.27
  pour Top (rank 2): -1.52,-1.91 60.2,-1.91 60.2,21.84 -1.52,21.84
  pour Route2: -1.52,-1.65 -1.52,21.84 21.08,21.84 21.08,22.23 -1.52,22.23 -1.52,51.56 60.2,51.56 60.2,22.23 27.81,22.23 27.81,21.84 60.2,21.84 60.2,-1.27 58.55,-1.27 58.17,-1.65
N$1
  Top 0.254: U16.3 44.34,40.11 | 40.26,40.74 U15.1
  Top 0.305: 44.34,40.11 42.69,40.11 arc-90 42.42,40.39 arc90 42.05,40.75 40.26,40.75 40.26,40.74
N$2
  Top 1.27: J3.1 50.73,9.02 51.69,9.02 52.58,8.13 52.58,4.01 S4.3
N$4
  Bottom 0.203: U2.31 17.24,21.17 R13.1
N$5
  Top 0.203: LED1.C R3.2
N$6
  Top 0.203: LED2.C R4.2
N$7
  Top 0.203: LED3.C R5.2
N$8
  Top 0.254: U12.3 20.17,29.86 arc90 20.19,29.84 | U13.5 21.72,29.84
  Top 0.305: 20.19,29.84 21.72,29.84
N$9
  Top 0.254: U13.3 23.07,30.25
  Top 0.305: 23.07,30.25 25.11,30.25 arc-90 C21.1
N$10
  Top 0.305: C21.2 27.83,30.23 arc90 27.84,30.21 U14.8
N$11
  Top 0.305: U14.5 29.09,32.74 C19.1 28.94,33.62 L1.2
N$12
  Top 0.203: LED4.C R14.2
N$13
  Top 0.305: U14.23 arc-90 31.81,30.23 32.51,30.23 C20.2
N$14
  Top 0.305: U14.3 30.09,32.75 C19.2
N$15
  Top 0.305: U14.16 30.09,26.3 arc-90 L4.1 arc-90 30.1,26.27 L3.1
N$16
  Top 0.203: LED5.C R15.2
N$17
  Top 0.305: R6.1 L2.1
N$18
  Top 0.305: U14.20 33.4,28.71 arc-90 R6.2
N$19
  Top 0.203: R16.2 LED6.C
N$20
  Top 0.305: L4.2 C25.1
N$21
  Top 0.203: R17.2 LED7.C
N$22
  Top 0.203: R18.2 LED8.C
N$24  (via drill 0.25)
  Top 0.203: v16.51,17.65 20.64,17.65 R18.1
  Bottom 0.203: U2.26 13.24,18.51 13.54,18.21 15.82,18.21 16.38,17.65 v16.51,17.65
N$25  (via drill 0.25)
  Top 0.203: v13.97,21.08 13.97,18.8 14.48,18.29 21.91,18.29 R17.1
  Bottom 0.203: U2.27 13.97,19.74 v13.97,21.08
N$26  (via drill 0.25)
  Top 0.203: v14.78,21.08 14.78,19.51 15.65,18.64 23.46,18.64 R16.1
  Bottom 0.203: U2.28 14.84,21.02 v14.78,21.08
N$27
  Top 0.254: U16.5 45.34,40.51 | U18.3 47.39,40.11 47.37,40.13 | U18.3 | U18.3
  Top 0.305: 45.34,40.51 45.85,40.51 46.23,40.13 47.37,40.13
N$28
  Top 0.254: HY2.P$4 22.61,43.06 R9.1
N$29  (via drill 0.25)
  Top 0.203: v15.6,21.08 15.6,19.71 16.31,19 24.24,19 26.59,16.65 R15.1
  Bottom 0.203: U2.29 15.64,21.04 v15.6,21.08
N$30
  Top 0.305: U17.8 36.68,41.16 C32.2
N$31
  pour Top (no thermals): 44.83,11.51 43,11.51 42.11,10.62 41.22,10.62 40.51,9.91 40.51,5.21 42.16,5.21 42.29,5.33 42.29,9.91 43.56,11.18 44.83,11.18
N$32  (via drill 0.25)
  Top 0.203: R3.1 16.55,16.65 v15.84,17.36
  Bottom 0.203: v15.84,17.36 14.96,17.36 14.47,17.86 13.39,17.86 12.44,18.81 U2.25
N$33
  Top 0.305: U17.5 33.64,38.38 C30.1 L5.2
N$34
  Top 0.305: U17.3 32.64,38.37 C30.2
N$35  (via drill 0.25)
  Top 0.203: R4.1 14.57,16.65 14.22,17 v14.22,17.27
  Bottom 0.203: v14.22,17.27 13.4,17.27 12.45,16.32 12.45,15.54 12.02,15.11 11.08,15.11 U2.20
N$36
  Top 0.254: U17.23 30.89,41.16
  Top 0.305: C31.2 30.38,41.16 30.89,41.16
N$37
  Top 0.305: R7.1 27.07,42.67 L6.1
N$38
  Top 0.305: U17.20 R7.2
N$39
  Top 0.305: U17.16 32.64,45.07 L8.1 32.65,46.33 L7.1
N$40
  Top 0.305: L8.2 C40.1
N$41  (via drill 0.25)
  Top 0.203: R5.1 12.86,16.21 12.85,16.21 12.45,15.8 v12.45,14.86
  Bottom 0.203: U2.19 12.14,14.29 12.45,14.61 v12.45,14.86
N$42  (via drill 0.25)
  Top 0.203: R14.1 10.56,16.65 9.65,15.75 v9.65,14.99
  Bottom 0.203: U2.18 11.04,13.51 9.72,13.51 9.45,13.78 9.45,14.16 9.65,14.36 v9.65,14.99
N$43
  Top 0.254: U18.5 48.51,40.51 | 50.85,40.74 U19.3 | U19.3
  Top 0.305: 50.85,40.74 50.27,40.74 50.04,40.51 48.51,40.51
N$44
  Top 0.254: U15.3 40.41,41.55 | 50.7,41.55 U19.1
  Top 0.305: 40.41,41.55 40.79,41.55 arc90 41.4,42.16 41.4,43.94 arc-90 42.16,44.7 49.02,44.7 arc-90 49.91,43.81 49.91,42.29 arc90 50.65,41.55 50.7,41.55
N$45
  Top 0.254: U15.5 39.24,41.15
  Top 0.305: 39.24,41.15 C32.1
N$46
  Top 0.203: C43.1 20.46,41.17 U20.4
N$47
  Top 0.254: HY2.P$6 23.75,42.93 23.82,42.87 | 23.82,42.87 R11.1 | U20.1 23.71,42.76 23.82,42.87
N$48
  Top 0.305: HY1.P$4 39.37,27.55 arc-90 R8.1
N$49
  Top 0.254: C44.1 40.56,32.02 U21.4
N$50
  Top 0.305: HY1.P$6 38.23,28.57 | 38.23,28.57 38.23,28.82 arc-90 R10.1 | U21.1 38.27,28.62 arc-90 38.23,28.57
N$51  (via drill 0.2 pad 0.15)
  Top 0.203: IC1.10 47.34,12.45 v48.26,12.45
  Bottom 0.203: v48.26,12.45 42.93,12.45 v42.55,12.06
  pour Top (no thermals): 44.83,11.86 44.83,12.06 43.69,12.06 43.31,12.45 37.97,12.45 37.97,11 41.99,11 42.85,11.86
N$52  (via drill 0.25)
  Top 0.203: v27.18,6.22 27.18,5.14 S5.P$1
  Bottom 0.203: R19.2 27.18,12.69 v27.18,6.22
N$53
  Top 0.254: IC1.1 43.83,12.43 42.69,13.57 C52.1
N$54
  Bottom 0.203: U2.6 23.44,14.29 C2.1 24.88,13.98 R19.1
N$60  (via drill 0.2 pad 0.15)
  Top 0.203: v39.62,39.37 39.55,39.44 U15.6
  Bottom 0.203: 29.74,19.28 29.46,19 28.72,19 Q1.3 | 29.74,19.28 29.75,19.28 29.75,19.68 29.46,19.97 29.06,19.97 29.04,19.94 27.81,19.94 26.04,21.72 25.9,21.72 25.04,22.58 25.04,25.53 25.38,25.86 26.27,25.86 26.55,25.58 30.02,25.58 31.39,26.95 31.39,32.66 31.75,33.02 37.34,38.61 38.86,38.61 v39.62,39.37 | R12.2 29.74,19.27 29.74,19.28
POWER+  (via drill 0.2 pad 0.15)
  Top 0.203: IC1.8 IC1.7 IC1.6 47.37,10.38 v47.37,8.89 | L9.2 43.94,7.42 43.94,8.13 v45.21,8.13
  Top 1.27: S4.2 49.25,5.21 43.69,5.21 42.86,4.38 C50.1
  Bottom 0.203: v47.37,8.89 46.61,8.13 v45.21,8.13
  pour Top (no thermals): 44.83,10.54 43.43,10.54 42.8,9.91 42.8,2.67 44.7,2.67 44.83,2.79
PWR_ADC1  (via drill 0.2 pad 0.15)
  Top 0.203: U20.7 23.06,35.87 v23.11,35.81 | v20.7,16.51 20.7,14.35 19.05,12.7 19.05,11.56 18.67,11.18 14.35,11.18 13.21,10.03 13.21,7.06 J1.5
  Bottom 0.203: v23.11,35.81 25.15,35.81 25.38,35.59 25.38,32.04 24.66,31.32 24.66,30.76 24.08,30.18 22.88,30.18 22.4,29.7 22.4,29.23 22.55,29.08 22.55,20.12 | 22.55,20.12 22.61,20.07 | U2.15 13.24,7.09 J1.5 | 22.55,20.12 22.55,18.36 v20.7,16.51
PWR_ADC2  (via drill 0.2 pad 0.15)
  Top 0.203: U21.7 38.92,35.7 v38.46,35.24 | v19.3,4.45 17.4,4.45 J1.6
  Bottom 0.203: v38.46,35.24 34.48,35.24 31.75,32.51 31.75,26.61 29.42,24.28 29.36,24.28 29.34,24.26 26.04,24.26 25.53,23.75 25.53,22.61 26.06,22.07 26.18,22.07 27.93,20.32 29.7,20.32 32.26,17.77 32.26,7.24 29.34,4.32 19.43,4.32 v19.3,4.45 | U2.14 14.04,7.8 J1.6
RESET  (via drill 0.25, 0.35)
  Top 0.203: S1.P$1 29.88,9.67 29.52,10.03 28.57,10.03 v28.45,10.16 | v18.03,13.72 18.03,12.7 17.53,12.19 10.41,12.19 7.58,15.02 v6.49,15.02 | J2.3 v3.63,17.6
  Bottom 0.203: v28.45,10.16 28.32,10.16 27.53,10.95 27.53,13.35 24.98,15.89 U2.4 18.69,15.89 17.9,15.11 17.9,13.85 v18.03,13.72 | v3.63,17.6 3.63,17.22 3.96,16.89 4.62,16.89 v6.49,15.02
RX_DIRECTIONAL_COUPLER
  Top 0.254: HY1.P$1 37.85,26.29
  Top 0.305: 37.85,26.29 36.46,26.29 | 36.46,26.29 arc-90 C26.1 | C25.2 36.46,26.29
RX_DSA_OUT
  Top 0.305: L2.2 35.94,31.1 arc90 C22.1 C20.1
RX_PATH_CELL
  Top 0.254: HY1.P$3 39.65,26.29 | U7.1 53.16,32.52
  Top 0.305: 39.65,26.29 51.79,26.29 arc90 53.16,27.66 53.16,32.52 arc-90 53.16,32.52
RX_PATH_TOWER
  Top 0.254: 19.05,29.46 U12.5
  Top 0.305: U5.1 16.37,39.38 | 16.37,39.38 arc-90 16.38,39.37 | 19.05,29.46 18.67,29.46 arc-90 18.03,30.1 18.03,38.35 arc90 17.01,39.38 16.37,39.38
SPI1_CS1  (via drill 0.2 pad 0.2, 0.25 pad 0.2)
  Top 0.203: v28.41,26.25 28.41,26.33 28.48,26.4 28.84,26.4 29.55,27.11 29.55,27.47 U14.15 | v17.27,10.16 23.24,10.16 25.16,12.08 28.11,12.08 28.7,12.67 28.7,18.03 v26.8,19.94
  Bottom 0.203: v28.41,26.25 27.47,26.25 27.28,26.06 26.57,26.06 26.41,26.21 24.87,26.21 24.69,26.04 24.69,22.43 25.78,21.34 25.9,21.34 26.8,20.44 v26.8,19.94 | U2.10 17.24,10.19 v17.27,10.16
SPI1_CS2  (via drill 0.25 pad 0.2)
  Top 0.203: U17.15 33.18,43.9 33.18,44.26 34.03,45.11 34.89,45.11 34.92,45.08 v35.17,45.08 | v18.8,10.69 18.97,10.52 23.09,10.52 25.02,12.45 27.97,12.45 28.34,12.81 28.34,17.89 26.82,19.41 26.58,19.41 26.06,19.92 24.56,19.92 v24.06,20.41
  Bottom 0.203: U2.9 18.66,10.69 v18.8,10.69 | v24.06,20.41 23.27,21.21 23.27,26.82 24.89,28.44 24.89,28.66 25.19,28.96 25.4,28.96 26.09,29.64 26.09,37.29 27.28,38.48 28.45,38.48 28.96,38.99 28.96,42.16 30.61,43.81 33.02,43.81 33.66,44.45 33.66,44.58 34.19,45.11 34.89,45.11 34.92,45.08 v35.17,45.08
SPI1_MISO  (via drill 0.2 pad 0.2, 0.25 pad 0.2)
  Top 0.203: v25.4,28.45 25.59,28.45 26.43,29.29 26.91,29.29 26.98,29.21 U14.10 | v15.62,10.16 16.51,9.27 17.64,9.27 17.82,9.45 23.54,9.45 25.46,11.37 28.41,11.37 29.41,12.38 29.41,18.58 27.16,20.83 26.66,20.83 26.51,20.98 25.3,20.98 v24.77,20.45 | U17.10 35.56,42.16 v35.81,42.42 | v26.8,37.25 28.42,37.25 v28.45,37.21
  Bottom 0.203: U2.12 15.64,10.18 v15.62,10.16 | v24.77,20.45 23.64,21.59 23.62,21.59 23.62,26.67 v25.4,28.45 26.44,29.49 26.44,36.89 v26.8,37.25 | v28.45,37.21 28.66,37.41 28.89,37.41 29.96,38.48 34.04,38.48 35.81,40.26 v35.81,42.42
SPI1_MOSI  (via drill 0.2 pad 0.2, 0.25 pad 0.2)
  Top 0.203: U14.14 29.05,27.47 29.05,27.11 28.7,26.75 v27.98,26.75 | v14.86,10.16 16.1,8.91 17.79,8.91 17.96,9.09 23.68,9.09 25.61,11.02 28.56,11.02 29.77,12.23 29.77,18.73 29.26,19.23 v29.26,19.48 | U17.14 33.68,43.9 33.68,44.26 34,44.58 34.92,44.58 34.95,44.55 35.46,44.55 v35.56,44.45
  Bottom 0.203: U2.13 14.84,10.18 v14.86,10.16 | v29.26,19.48 27.1,19.48 27.02,19.41 26.58,19.41 26.16,19.82 26.16,20.57 25.75,20.98 25.63,20.98 24.33,22.28 24.33,26.25 24.65,26.57 26.56,26.57 26.71,26.42 27.13,26.42 27.47,26.75 v27.98,26.75 27.81,26.92 27.81,28.82 27.15,29.48 27.15,36.3 27.79,36.94 27.79,37.34 28.22,37.77 28.74,37.77 30.2,39.23 30.2,42.4 30.91,43.1 33.31,43.1 33.86,43.65 34.58,43.65 34.78,43.45 35.22,43.45 35.53,43.77 35.53,44.42 v35.56,44.45
SPI1_SCK  (via drill 0.2 pad 0.2, 0.25 pad 0.2)
  Top 0.203: U14.13 28.51,27.43 27.94,27.43 27.43,26.92 v26.92,26.92 | v16.38,10.16 16.92,9.63 17.49,9.63 17.67,9.8 23.39,9.8 25.31,11.73 28.26,11.73 29.06,12.52 29.06,18.43 27.02,20.47 26.52,20.47 26.42,20.57 25.65,20.57 v25.53,20.45 | U17.13 34.33,44.04 34.95,44.04 v35,43.99
  Bottom 0.203: U2.11 16.44,10.22 v16.38,10.16 | v25.53,20.45 23.98,22 23.98,26.52 24.38,26.92 v26.92,26.92 26.92,27.19 27.46,27.72 27.46,28.68 26.8,29.34 26.8,36.45 27.43,37.08 27.43,37.48 28.07,38.12 28.59,38.12 29.84,39.38 29.84,42.55 30.76,43.46 33.17,43.46 33.72,44.01 34.98,44.01 v35,43.99
SWCLK  (via drill 0.25)
  Top 0.203: J2.4 v4.93,17.63
  Bottom 0.203: v4.93,17.63 4.93,17.65 5.85,18.57 10.78,18.57 U2.24
SWDIO  (via drill 0.25)
  Top 0.203: J2.2 4.88,18.85 5.16,18.57 8.61,18.57 v9.65,17.53
  Bottom 0.203: v9.65,17.53 11.03,17.53 U2.23
TOWER_ANT
  Top 0.305: X1.ANTENNA arc-90 8.27,40.02 L12.2 14.77,40.02 arc-90 U5.6
TX_DIRECTIONAL_COUPLER
  Top 0.305: C40.2 28.8,45.07 C41.1 24.37,45.07 arc90 23.75,44.45 HY2.P$1
TX_DSA_OUT
  Top 0.305: L6.2 27.05,40.15 C35.1 C31.1
TX_LNA_BYPASS  (via drill 0.2 pad 0.15)
  Top 0.203: v20.34,8.64 20.45,8.74 23.83,8.74 25.75,10.66 28.7,10.66 30.12,12.08 30.12,15.39 v30.23,15.49 | v52.32,42.55 52.32,41.91 51.97,41.55 U19.6
  Bottom 0.203: S3.2 17.4,3.43 20.34,6.38 J1.8 v20.34,8.64 20.34,9.17 22.61,11.43 22.61,12.45 21.98,13.07 R2.2 21.17,13.49 v20.57,13.49 U2.7 | v30.23,15.49 29.52,16.2 Q1.1 27.81,17.66 27.81,17.86 27.52,18.16 27.31,18.16 25.66,19.81 23.98,19.81 22.91,20.88 22.91,27.48 24.36,28.93 24.36,29.57 24.66,29.87 25.12,29.87 25.73,30.48 25.73,37.44 27.13,38.84 28.07,38.84 28.6,39.37 28.6,43.71 28.32,43.99 28.32,44.41 28.62,44.7 33.28,44.7 34.14,45.56 35.37,45.56 35.85,45.09 38.1,45.09 40.51,42.67 40.85,42.67 41.36,42.16 42.12,42.16 42.5,41.78 48.96,41.78 49.12,41.63 49.54,41.63 49.69,41.78 50.42,41.78 51.44,42.8 52.07,42.8 v52.32,42.55
TX_PATH_CELL
  Top 0.254: U7.3 53.16,34.53 | 52.2,41.15 U19.5
  Top 0.305: 53.16,34.53 53.16,40.18 arc90 52.2,41.15
TX_PATH_TOWER
  Top 0.254: 16,40.64 U5.3
  Top 0.305: HY2.P$3 19.3,44.2 arc90 18.16,43.05 18.16,41.53 arc-90 17.27,40.64 16,40.64
USB_D_N
  Bottom 0.305: U2.21 9.67,15.89 9.53,16.04 9.18,16.04 6.91,13.77 6.91,11.86 | 6.91,11.86 | J4.2 5,9.27 6.1,9.27 6.91,10.08 6.91,11.86
USB_D_P
  Bottom 0.305: U2.22 9.67,16.69 9.53,16.55 8.97,16.55 6.35,13.93 6.35,12.68 J4.3

### Text on the board
tPlace: TX | Tower Antenna | RX | LTE Repeater v1.0.0 | Cellular Antenna | Band 12 | Uplink: 698-719MHz | Downlink: 728-746MHz | Charles H | Uplink | Downlink | Reset | 5V | 3VA | 3VD | GND | TX BYPASS | ON | -----> | SW | OFF | ON | OFF